# Altium project Platine_2_Intel_CPLD.PrjPcb
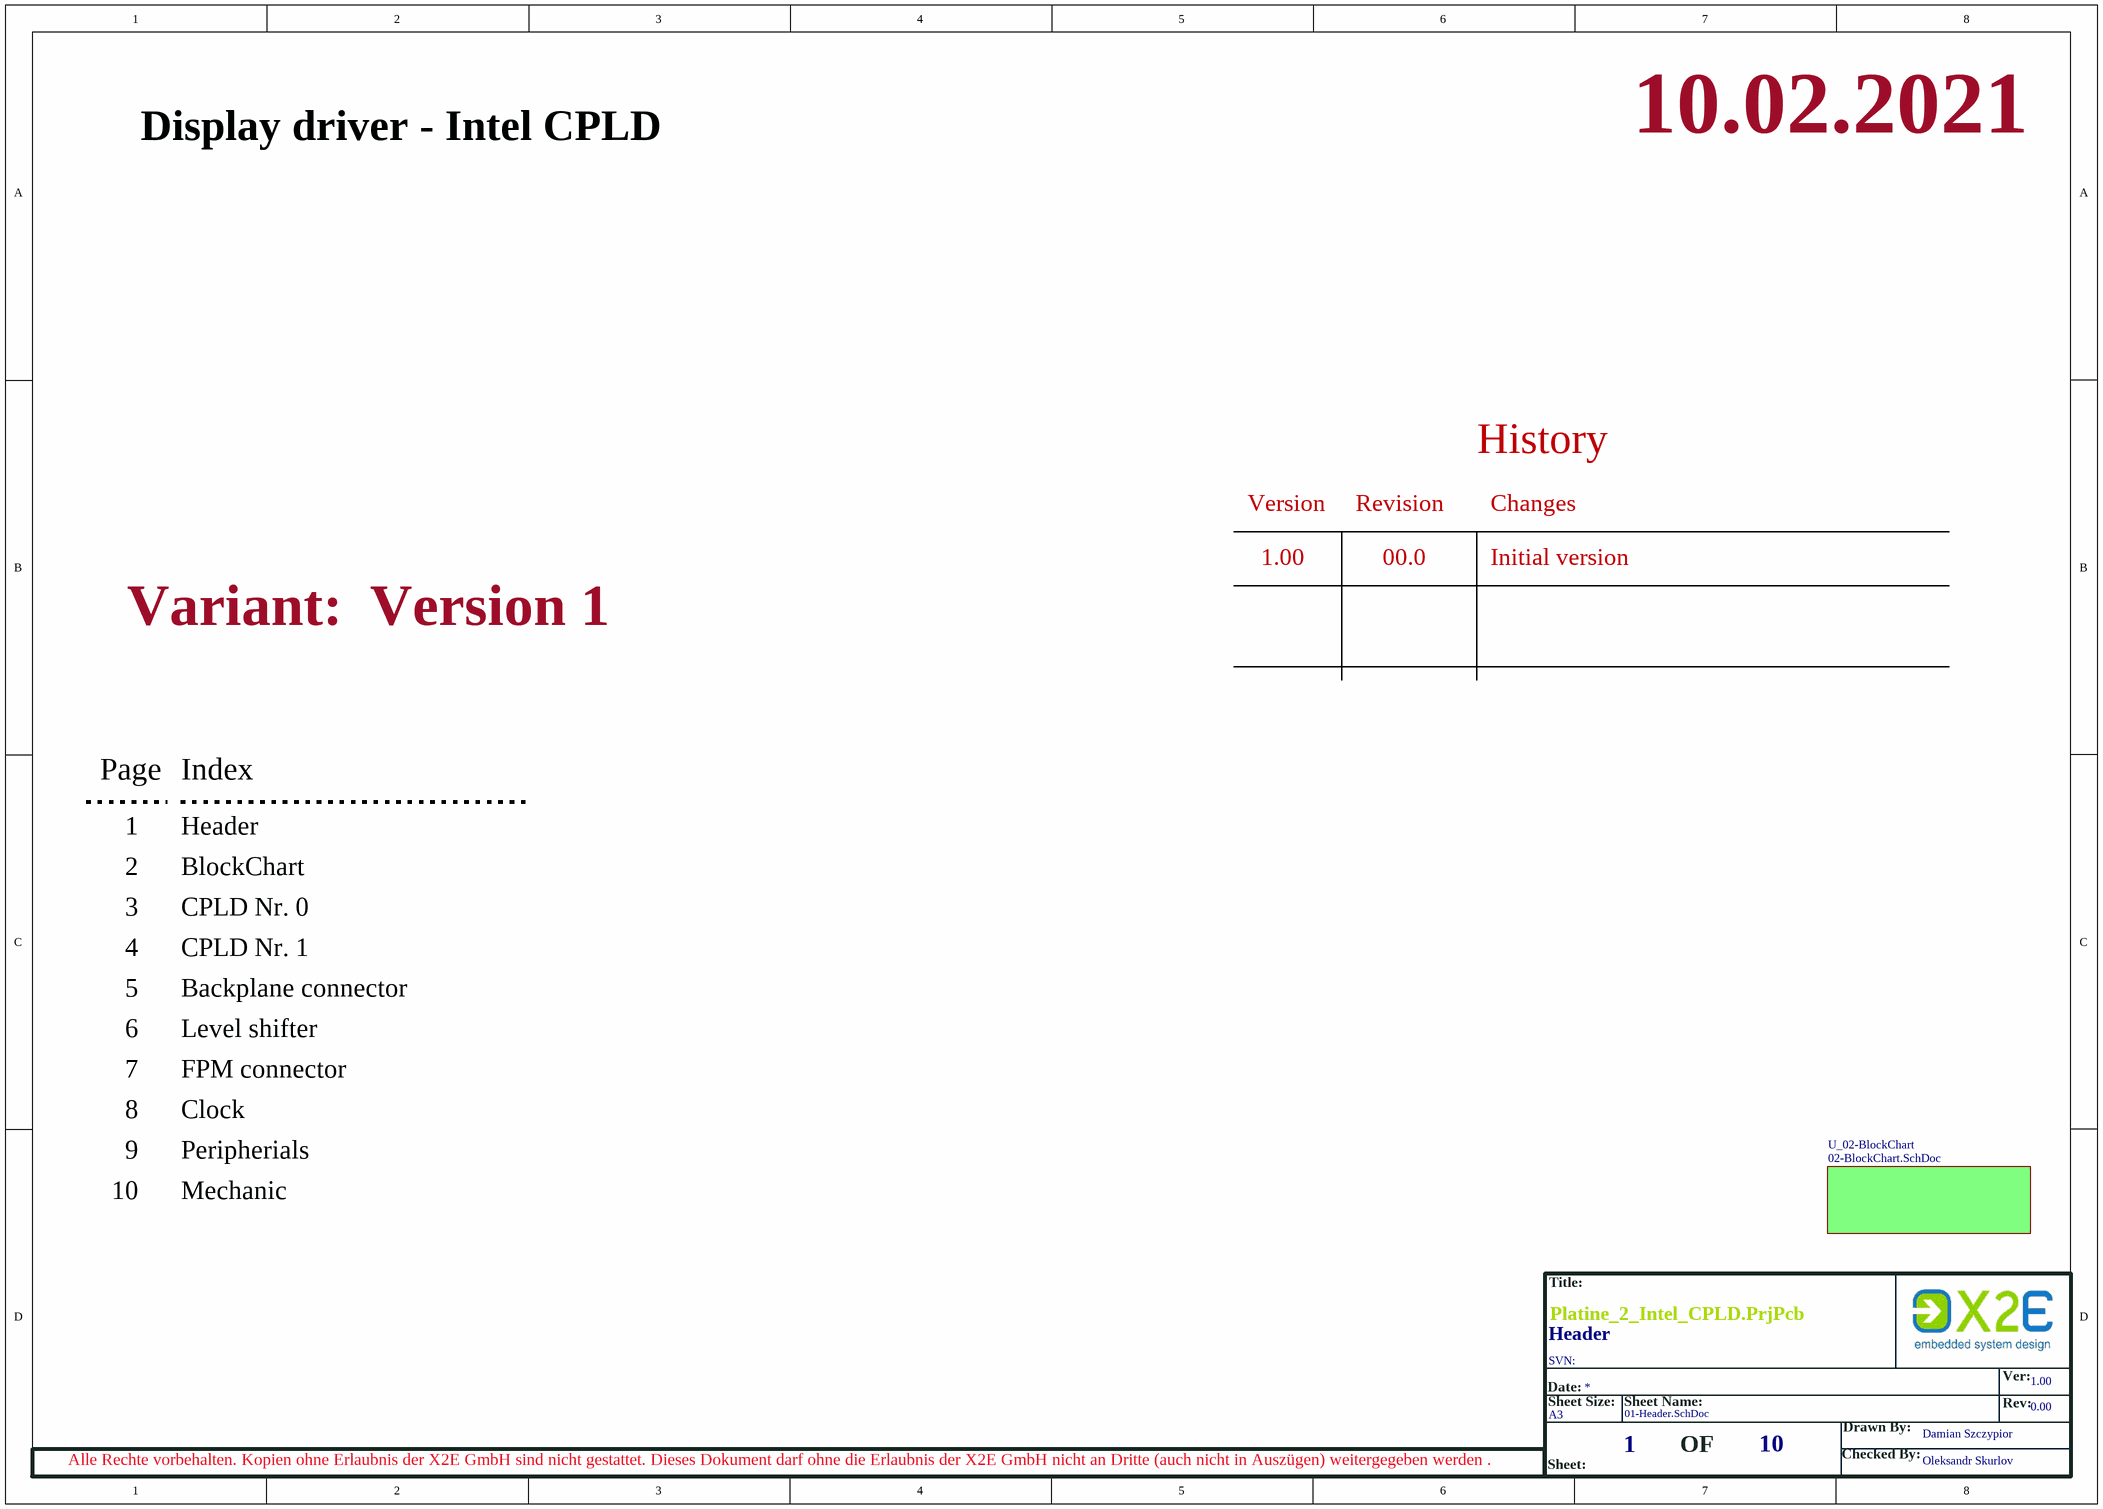
[diagram p0: 01-Header.SchDoc]
10 sheets, 93 parts. Net scope: hierarchical (ports join the sheet entries above them; power ports are global).
Board file: Platine_2_Intel_CPLD.PcbDoc
Sheets:
  01-Header.SchDoc
    U_02-BlockChart = 02-BlockChart.SchDoc
      U_09-Peripherials = 09-Peripherials.SchDoc
      U_03-Intel_CPLD_0 = 03-Intel_CPLD_0.SchDoc
      U_04-Intel_CPLD_1 = 04-Intel_CPLD_1.SchDoc
      U_05-Backplane_Connector = 05-Backplane_Connector.SchDoc
      U_06-LevelShifter = 06-LevelShifter.SchDoc
      U_08-Clock = 08-Clock.SchDoc
      U_07-FPM_Connector = 07-FPM_Connector.SchDoc
      U_10-Mechanic = 10-Mechanic.SchDoc

## Sheet 01-Header.SchDoc: Header
size A3; CheckedBy: Oleksandr Skurlov; CompanyName: X2E GmbH; Engineer: Nader Aribi; Revision: 0.00; SheetNumber: 1; SheetTotal: 10; Version: 1.00; Address: Jahnstr. 2b 76870 Kandel; PageSetup: Record=PageOptions|CenterHorizontal=True|CenterVertical=True|PrintScale=1.01|XCorrection=1.00|YCorrection=1.00|PrintKind=0|BorderSize=5000000|LeftOffset=0|BottomOffset=0|Orientation=2|PaperLength=1000|PaperWidth=1000|Scale=100|PaperSource=15|PrintQuality=600|MediaType=1|DitherType=10|PrintScaleMode=1|PaperKind=A3

### Sub-sheets
U_02-BlockChart = 02-BlockChart.SchDoc: no entries

### Notes on the sheet
- 10.02.2021
- Display driver - Intel CPLD
- Version
- Revision
- History
- Changes
- 1.00
- 00.0
- Initial version
- Variant:
- Version 1
- Page
- Index
- 1
- Header
- 2
- 3
- BlockChart
- CPLD Nr. 0
- 4
- CPLD Nr. 1
- 5
- 6
- Backplane connector
- Level shifter
- 7
- 8
- FPM connector
- Clock
- 9
- Peripherials
- 10
- Mechanic
- Title:
- Date:
- SVN:
- Ver:
- Sheet Size:
- A3
- Sheet Name:
- OF
- Checked By:
- Drawn By:
- Damian Szczypior
- Rev:
- Alle Rechte vorbehalten. Kopien ohne Erlaubnis der X2E GmbH sind nicht gestattet. Dieses Dokument darf ohne die Erlaubnis der X2E GmbH nicht an Dritte (auch nicht in Auszügen) weitergegeben werden .
- Sheet:

## Sheet 02-BlockChart.SchDoc
size A3; SheetNumber: 1; SheetTotal: 7
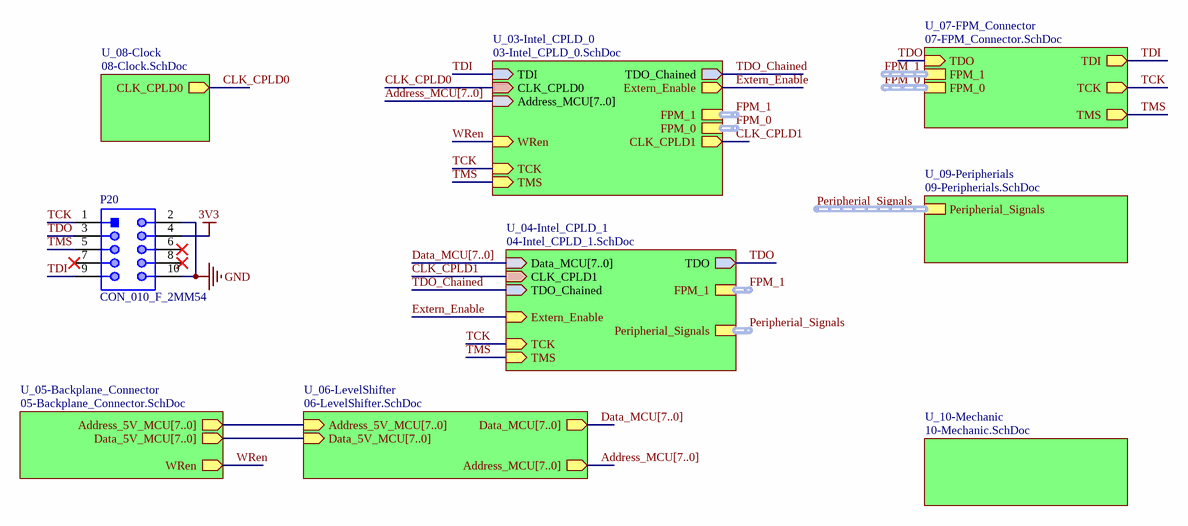
[diagram p1: 02-BlockChart.SchDoc]

### Parts
P20  CON_010_F_2MM54  [CON_010_F_2MM54_Intel_Altera]

### Sub-sheets
U_03-Intel_CPLD_0 = 03-Intel_CPLD_0.SchDoc: TDI (in), TDO_Chained (out), CLK_CPLD0 (in), Address_MCU[7..0] (in), Extern_Enable (out), FPM_1 (harness FPM_Signals_CPLD_1), FPM_0 (harness FPM_Signals_CPLD_0), WRen (in), CLK_CPLD1 (out), TCK (in), TMS (in)
U_04-Intel_CPLD_1 = 04-Intel_CPLD_1.SchDoc: Data_MCU[7..0] (in), CLK_CPLD1 (in), TDO_Chained (in), TDO (out), FPM_1 (harness FPM_Signals_CPLD_1), Extern_Enable (in), Peripherial_Signals (harness Peripherial_Signals), TCK (in), TMS (in)
U_05-Backplane_Connector = 05-Backplane_Connector.SchDoc: Address_5V_MCU[7..0] (out), Data_5V_MCU[7..0] (out), WRen (out)
U_06-LevelShifter = 06-LevelShifter.SchDoc: Address_5V_MCU[7..0] (in), Data_5V_MCU[7..0] (in), Data_MCU[7..0] (out), Address_MCU[7..0] (out)
U_07-FPM_Connector = 07-FPM_Connector.SchDoc: TDI (out), TDO (in), FPM_1 (harness FPM_Signals_CPLD_1), FPM_0 (harness FPM_Signals_CPLD_0), TCK (out), TMS (out)
U_08-Clock = 08-Clock.SchDoc: CLK_CPLD0 (out)
U_09-Peripherials = 09-Peripherials.SchDoc: Peripherial_Signals (harness Peripherial_Signals)
U_10-Mechanic = 10-Mechanic.SchDoc: no entries

### Nets
3V3: P20.4
GND: P20.2 P20.10
CLK_CPLD0: sheet U_03-Intel_CPLD_0/CLK_CPLD0, sheet U_08-Clock/CLK_CPLD0
CLK_CPLD1: sheet U_03-Intel_CPLD_0/CLK_CPLD1, sheet U_04-Intel_CPLD_1/CLK_CPLD1
Extern_Enable: sheet U_03-Intel_CPLD_0/Extern_Enable, sheet U_04-Intel_CPLD_1/Extern_Enable
TCK: P20.1 ; sheet U_03-Intel_CPLD_0/TCK, sheet U_04-Intel_CPLD_1/TCK, sheet U_07-FPM_Connector/TCK
TDI: P20.9 ; sheet U_03-Intel_CPLD_0/TDI, sheet U_07-FPM_Connector/TDI
TDO: P20.3 ; sheet U_04-Intel_CPLD_1/TDO, sheet U_07-FPM_Connector/TDO
TDO_Chained: sheet U_03-Intel_CPLD_0/TDO_Chained, sheet U_04-Intel_CPLD_1/TDO_Chained
TMS: P20.5 ; sheet U_03-Intel_CPLD_0/TMS, sheet U_04-Intel_CPLD_1/TMS, sheet U_07-FPM_Connector/TMS
WRen: sheet U_03-Intel_CPLD_0/WRen, sheet U_05-Backplane_Connector/WRen

Not connected (* = marked no-connect by the designer): P20 6* 7* 8*

### Buses and harness runs
bus Address_MCU[7..0] = sheet U_03-Intel_CPLD_0/Address_MCU[7..0]
bus Address_MCU[7..0] = sheet U_06-LevelShifter/Address_MCU[7..0]
bus Data_MCU[7..0] = sheet U_04-Intel_CPLD_1/Data_MCU[7..0]
bus Data_MCU[7..0] = sheet U_06-LevelShifter/Data_MCU[7..0]
bus sheet U_05-Backplane_Connector/Address_5V_MCU[7..0] = sheet U_06-LevelShifter/Address_5V_MCU[7..0]
bus sheet U_05-Backplane_Connector/Data_5V_MCU[7..0] = sheet U_06-LevelShifter/Data_5V_MCU[7..0]
harness FPM_0 = sheet U_03-Intel_CPLD_0/FPM_0
harness FPM_0 = sheet U_07-FPM_Connector/FPM_0
harness FPM_1 = sheet U_03-Intel_CPLD_0/FPM_1
harness FPM_1 = sheet U_04-Intel_CPLD_1/FPM_1
harness FPM_1 = sheet U_07-FPM_Connector/FPM_1
harness Peripherial_Signals = sheet U_04-Intel_CPLD_1/Peripherial_Signals
harness Peripherial_Signals = sheet U_09-Peripherials/Peripherial_Signals

### Notes on the sheet
- Title:
- Date:
- SVN:
- Ver:
- Sheet Size:
- A3
- Sheet Name:
- OF
- Checked By:
- Drawn By:
- Damian Szczypior
- Rev:
- Alle Rechte vorbehalten. Kopien ohne Erlaubnis der X2E GmbH sind nicht gestattet. Dieses Dokument darf ohne die Erlaubnis der X2E GmbH nicht an Dritte (auch nicht in Auszügen) weitergegeben werden .
- Sheet:

### Library data of the parts
P20 = CON_010_F_2MM54: Male Box Header WR-BHD, THT, Vertical, pitch 2.54 mm, 10 pins

## Sheet 09-Peripherials.SchDoc
size A3; SheetNumber: 2; SheetTotal: 7
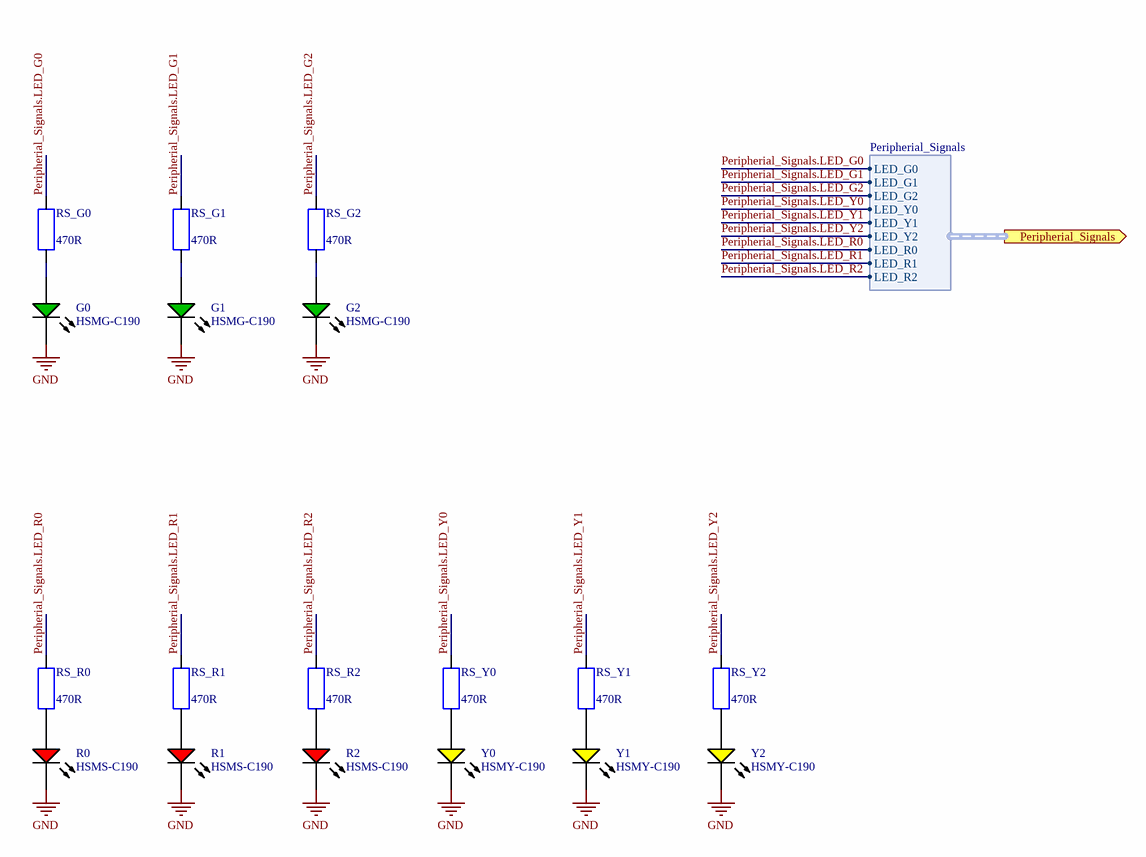
[diagram p2: 09-Peripherials.SchDoc]

### Parts
G0  HSMG-C190  [AVAG-HSMX-C190_V]
G1  HSMG-C190  [AVAG-HSMX-C190_V]
G2  HSMG-C190  [AVAG-HSMX-C190_V]
R0  HSMS-C190  [AVAG-HSMX-C190_V]
R1  HSMS-C190  [AVAG-HSMX-C190_V]
R2  HSMS-C190  [AVAG-HSMX-C190_V]
RS_G0  resistance: 470R  [0603_A]  (hidden comment: RS)
RS_G1  resistance: 470R  [0603_A]  (hidden comment: RS)
RS_G2  resistance: 470R  [0603_A]  (hidden comment: RS)
RS_R0  resistance: 470R  [0603_A]  (hidden comment: RS)
RS_R1  resistance: 470R  [0603_A]  (hidden comment: RS)
RS_R2  resistance: 470R  [0603_A]  (hidden comment: RS)
RS_Y0  resistance: 470R  [0603_A]  (hidden comment: RS)
RS_Y1  resistance: 470R  [0603_A]  (hidden comment: RS)
RS_Y2  resistance: 470R  [0603_A]  (hidden comment: RS)
Y0  HSMY-C190  [AVAG-HSMX-C190_V]
Y1  HSMY-C190  [AVAG-HSMX-C190_V]
Y2  HSMY-C190  [AVAG-HSMX-C190_V]

### Ports
Peripherial_Signals (out, harness Peripherial_Signals)

### Harnesses
Peripherial_Signals: LED_G0, LED_G1, LED_G2, LED_Y0, LED_Y1, LED_Y2, LED_R0, LED_R1, LED_R2

### Nets
GND: G0.2(K) G1.2(K) G2.2(K) R0.2(K) R1.2(K) R2.2(K) Y0.2(K) Y1.2(K) Y2.2(K)
Peripherial_Signals.LED_G0: RS_G0.2 ; port Peripherial_Signals.LED_G0
Peripherial_Signals.LED_G1: RS_G1.2 ; port Peripherial_Signals.LED_G1
Peripherial_Signals.LED_G2: RS_G2.2 ; port Peripherial_Signals.LED_G2
Peripherial_Signals.LED_R0: RS_R0.2 ; port Peripherial_Signals.LED_R0
Peripherial_Signals.LED_R1: RS_R1.2 ; port Peripherial_Signals.LED_R1
Peripherial_Signals.LED_R2: RS_R2.2 ; port Peripherial_Signals.LED_R2
Peripherial_Signals.LED_Y0: RS_Y0.2 ; port Peripherial_Signals.LED_Y0
Peripherial_Signals.LED_Y1: RS_Y1.2 ; port Peripherial_Signals.LED_Y1
Peripherial_Signals.LED_Y2: RS_Y2.2 ; port Peripherial_Signals.LED_Y2
NetG0_1: G0.1(A) RS_G0.1
NetG1_1: G1.1(A) RS_G1.1
NetG2_1: G2.1(A) RS_G2.1
NetR0_1: R0.1(A) RS_R0.1
NetR1_1: R1.1(A) RS_R1.1
NetR2_1: R2.1(A) RS_R2.1
NetRS_Y0_1: RS_Y0.1 Y0.1(A)
NetRS_Y1_1: RS_Y1.1 Y1.1(A)
NetRS_Y2_1: RS_Y2.1 Y2.1(A)

### Notes on the sheet
- Title:
- Date:
- SVN:
- Ver:
- Sheet Size:
- A3
- Sheet Name:
- OF
- Checked By:
- Drawn By:
- Damian Szczypior
- Rev:
- Alle Rechte vorbehalten. Kopien ohne Erlaubnis der X2E GmbH sind nicht gestattet. Dieses Dokument darf ohne die Erlaubnis der X2E GmbH nicht an Dritte (auch nicht in Auszügen) weitergegeben werden .
- Sheet:

### Library data of the parts
G0-G2 = CMP-1744-00002-1: Chip LED, Green, 2.2 V, -40 to 85 degC, 2-Pin SMD, RoHS, Tape and Reel; Frequency: 400 KHz; Max Supply Voltage: 5.5 V; Access Time: 3500 ns; Clock Frequency: 100 KHz; Case\Package: SOIC; Density: 32 kb; Nominal Supply Current: 2 mA; Interface: Serial; Min Supply Voltage: 1.7 V; Packaging: Tape and Reel; PackageReference: HSMX-C190; ComponentLink2URL: http://docs.avagotech.com/docs/AV02-0551EN; RoHSCompliant: true; Pins: 8; REACH SVHC: No SVHC; Max Operating Temperature: 85 degC; Width: 4 mm; Radiation Hardening: No; Package Quantity: 3000; ComponentLink3Description: Package Specification; ComponentLink1Description: Manufacturer URL; Min Operating Temperature: -40 degC; PackageDescription: 2-Pin Surface Mount Device, Body 1.6 x 0.8 mm, Height 0.9 mm; Max Clock Frequency: 100 KHz; Height: 1.5 mm; ComponentLink1URL: http://www.avagotech.com/; DatasheetVersion: Mar-12; ComponentLink2Description: Datasheet; Mount: Surface Mount; Length: 5 mm; ComponentLink3URL: http://www.fairchildsemi.com/dwg/MA/MA03D.pdf
R0-R2 = CMP-2000-06427-1: LED Uni-Color Red, 52 mW, 20 mA, -40 to 85 degC, 2-Pin SMD, RoHS, Tape and Reel; Manufacturer: Avago; Reverse Voltage: 5V; Viewing Angle: 170deg; High Brightness: No; Lens Type: ColorlessDiffused; DELETED: Compliant; Product Height (mm): 0.8mm; Dominant Wave Length: 626nm; Number of  Elements: 1; Chip Material: GaP; Lum Intensity: 10mcd; Product Length (mm): 1.6mm; Forward Voltage: 2.6V; Power Dissipation: 52W; Shape Type: Rectangular; Forward Current: 25mA; Peak Wavelength: 630nm; Test Current (It): 20mA; Main Category: ChipLED; Lens Dimensions: 1x0.8x0.5mm; Pin Count: 2; Package Reference: HSMX-C190; Mounting Technology: SurfaceMount; Mounting: SurfaceMount; Datasheet URL: http://docs.avagotech.com/docs/AV02-0551EN; Package Type: ChipLed; Operating Temperature Classification: Industrial; Datasheet Version: 03/2012; Operating Temp Range: -40Cto85C; Emitting Color: Red; Rad Hardened: No; Manufacturer URL: http://www.avagotech.com/; Luminous Intensity: 10mcd; Package Description: 2-Pin Surface Mount Device, Body 1.6 x 0.8 mm, Height 0.9 mm; Type: Uni-Color; Packaging: TapeandReel; Product Depth (mm): 0.8mm
RS_G0-RS_G2 RS_R0-RS_R2 RS_Y0-RS_Y2 = X_00000061: manufacturer: Yageo; entity_name: RS_0603_470R_W100_1P00_100PPM; entity_type_name: resistor_standard; power: W100; temp_coefficient: 100PPM; tolerance: 1P00; release: blocked; max_operating_temp: 125C; min_operating_temp: -55C; ordering_information_btm: 311-470HRDKR-ND; used_in_bom: 1; production_status: Aktiv; x2e_number: X_00000061; series: RC0603; height: mm450; width: mm800; length: 1mm60; package: 0603
Y0-Y2 = CMP-1744-00003-1: LED Uni-Color Yellow, 65 mW, 20 mA, -40 to 85 degC, 2-Pin SMD, RoHS, Tape and Reel; Tolerance: 1%; Voltage Rating: 50 V; Power Rating: 100 mW; Case\Package: 0603; Resistance: 390 Ohm; Min Operating Temperature: -55 degC; Length: 1.6 mm; ComponentLink3Description: Package Specification; Mount: Surface Mount; PackageReference: HSMX-C190; ComponentLink2Description: Datasheet; DatasheetVersion: Mar-12; Case Code (Metric): 1608; Pins: 2; Package Quantity: 5000; ComponentLink2URL: http://docs.avagotech.com/docs/AV02-0551EN; ComponentLink1Description: Manufacturer URL; RoHSCompliant: true; Packaging: Tape and Reel; PackageDescription: 2-Pin Surface Mount Device, Body 1.6 x 0.8 mm, Height 0.9 mm; REACH SVHC: No SVHC; ComponentLink3URL: http://www.fairchildsemi.com/dwg/MA/MA03D.pdf; Voltage Rating (DC): 50 V; Width: 0.8 mm; ComponentLink1URL: http://www.avagotech.com/; Max Operating Temperature: 155 degC; Case Code (Imperial): 0603; Height: 0.45 mm

## Sheet 03-Intel_CPLD_0.SchDoc
size A3; SheetNumber: 5; SheetTotal: 7
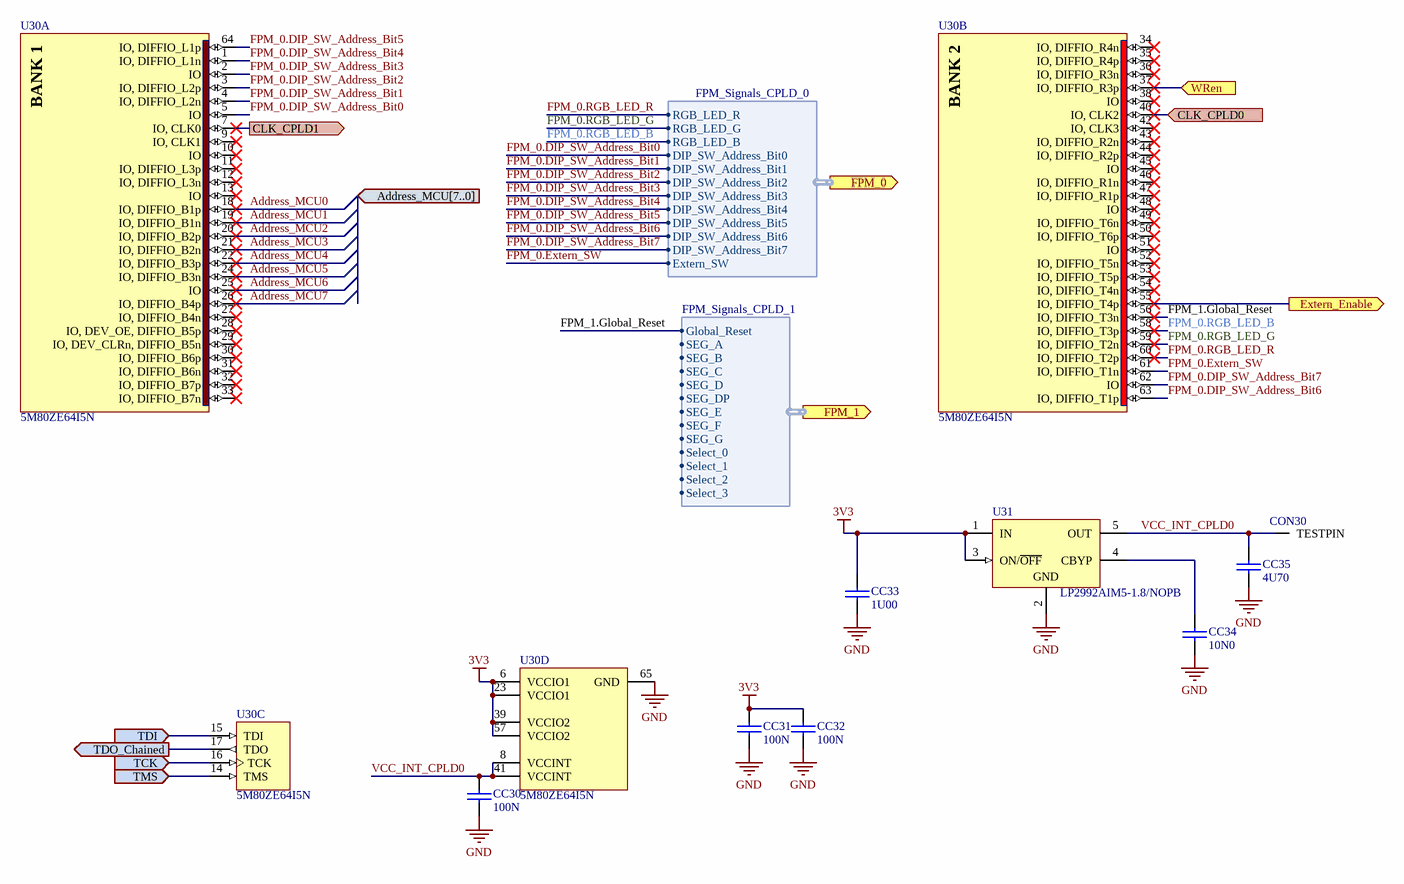
[diagram p3: 03-Intel_CPLD_0.SchDoc]

### Parts
CC30  capacitance: 100N  [0603_C]  (hidden comment: CC)
CC31  capacitance: 100N  [0603_C]  (hidden comment: CC)
CC32  capacitance: 100N  [0603_C]  (hidden comment: CC)
CC33  capacitance: 1U00  [0603_C]  (hidden comment: CC)
CC34  capacitance: 10N0  [0603_C]  (hidden comment: CC)
CC35  capacitance: 4U70  [0603_C]  (hidden comment: CC)
CON30  CON_001_M_MM000_S_X_MILL-MAX_TP  [CON_001_THT_MM000_S_D]  (value not drawn)
U30  5M80ZE64I5N  [EQFP64_A-120_D2-45_M]  (parts A,B,C,D of 4)
U31  LP2992AIM5-1.8/NOPB  [MF05A_N]

### Ports
Address_MCU[7..0] (in), CLK_CPLD0 (in), CLK_CPLD1 (out), Extern_Enable (out), FPM_0 (out, harness FPM_Signals_CPLD_0), FPM_1 (out, harness FPM_Signals_CPLD_1), TCK (in), TDI (in), TDO_Chained (out), TMS (in), WRen (in)

### Harnesses
FPM_Signals_CPLD_0: RGB_LED_R, RGB_LED_G, RGB_LED_B, DIP_SW_Address_Bit0, DIP_SW_Address_Bit1, DIP_SW_Address_Bit2, DIP_SW_Address_Bit3, DIP_SW_Address_Bit4, DIP_SW_Address_Bit5, DIP_SW_Address_Bit6, DIP_SW_Address_Bit7, Extern_SW
FPM_Signals_CPLD_1: Global_Reset, SEG_A, SEG_B, SEG_C, SEG_D, SEG_DP, SEG_E, SEG_F, SEG_G, Select_0, Select_1, Select_2, Select_3

### Nets
3V3: CC31.2 CC32.2 CC33.2 U30.6(VCCIO1) U30.23(VCCIO1) U30.39(VCCIO2) U30.57(VCCIO2) U31.1(IN) U31.3(ON/~{OFF})
GND: CC30.1 CC31.1 CC32.1 CC33.1 CC34.1 CC35.1 U30.65(GND) U31.2(GND)
Address_MCU0: U30.18(IO,_DIFFIO_B1p)
Address_MCU1: U30.19(IO,_DIFFIO_B1n)
Address_MCU2: U30.20(IO,_DIFFIO_B2p)
Address_MCU3: U30.21(IO,_DIFFIO_B2n)
Address_MCU4: U30.22(IO,_DIFFIO_B3p)
Address_MCU5: U30.24(IO,_DIFFIO_B3n)
Address_MCU6: U30.25(IO)
Address_MCU7: U30.26(IO,_DIFFIO_B4p)
CLK_CPLD0: U30.40(IO,_CLK2) ; port CLK_CPLD0
CLK_CPLD1: U30.7(IO,_CLK0) ; port CLK_CPLD1
Extern_Enable: U30.55(IO,_DIFFIO_T4p) ; port Extern_Enable
FPM_0.DIP_SW_Address_Bit0: U30.5(IO) ; port FPM_0.DIP_SW_Address_Bit0
FPM_0.DIP_SW_Address_Bit1: U30.4(IO,_DIFFIO_L2n) ; port FPM_0.DIP_SW_Address_Bit1
FPM_0.DIP_SW_Address_Bit2: U30.3(IO,_DIFFIO_L2p) ; port FPM_0.DIP_SW_Address_Bit2
FPM_0.DIP_SW_Address_Bit3: U30.2(IO) ; port FPM_0.DIP_SW_Address_Bit3
FPM_0.DIP_SW_Address_Bit4: U30.1(IO,_DIFFIO_L1n) ; port FPM_0.DIP_SW_Address_Bit4
FPM_0.DIP_SW_Address_Bit5: U30.64(IO,_DIFFIO_L1p) ; port FPM_0.DIP_SW_Address_Bit5
FPM_0.DIP_SW_Address_Bit6: U30.63(IO,_DIFFIO_T1p) ; port FPM_0.DIP_SW_Address_Bit6
FPM_0.DIP_SW_Address_Bit7: U30.62(IO) ; port FPM_0.DIP_SW_Address_Bit7
FPM_0.Extern_SW: U30.61(IO,_DIFFIO_T1n) ; port FPM_0.Extern_SW
FPM_0.RGB_LED_B: U30.58(IO,_DIFFIO_T3p) ; port FPM_0.RGB_LED_B
FPM_0.RGB_LED_G: U30.59(IO,_DIFFIO_T2n) ; port FPM_0.RGB_LED_G
FPM_0.RGB_LED_R: U30.60(IO,_DIFFIO_T2p) ; port FPM_0.RGB_LED_R
FPM_1.Global_Reset: U30.56(IO,_DIFFIO_T3n) ; port FPM_1.Global_Reset
TCK: U30.16(TCK) ; port TCK
TDI: U30.15(TDI) ; port TDI
TDO_Chained: U30.17(TDO) ; port TDO_Chained
TMS: U30.14(TMS) ; port TMS
VCC_INT_CPLD0: CC30.2 CC35.2 CON30.1(TESTPIN) U30.8(VCCINT) U30.41(VCCINT) U31.5(OUT)
WRen: U30.37(IO,_DIFFIO_R3p) ; port WRen
NetCC34_2: CC34.2 U31.4(CBYP)

Not connected (* = marked no-connect by the designer): U30 9(IO,_CLK1)* 10(IO)* 11(IO,_DIFFIO_L3p)* 12(IO,_DIFFIO_L3n)* 13(IO)* 27(IO,_DIFFIO_B4n)* 28(IO,_DEV_OE,_DIFFIO_B5p)* 29(IO,_DEV_CLRn,_DIFFIO_B5n)* 30(IO,_DIFFIO_B6p)* 31(IO,_DIFFIO_B6n)* 32(IO,_DIFFIO_B7p)* 33(IO,_DIFFIO_B7n)* 34(IO,_DIFFIO_R4n)* 35(IO,_DIFFIO_R4p)* 36(IO,_DIFFIO_R3n)* 38(IO)* 42(IO,_CLK3)* 43(IO,_DIFFIO_R2n)* 44(IO,_DIFFIO_R2p)* 45(IO)* 46(IO,_DIFFIO_R1n)* 47(IO,_DIFFIO_R1p)* 48(IO)* 49(IO,_DIFFIO_T6n)* 50(IO,_DIFFIO_T6p)* 51(IO)* 52(IO,_DIFFIO_T5n)* 53(IO,_DIFFIO_T5p)* 54(IO,_DIFFIO_T4n)*

### Notes on the sheet
- Title:
- Date:
- SVN:
- Ver:
- Sheet Size:
- A3
- Sheet Name:
- OF
- Checked By:
- Drawn By:
- Damian Szczypior
- Rev:
- Alle Rechte vorbehalten. Kopien ohne Erlaubnis der X2E GmbH sind nicht gestattet. Dieses Dokument darf ohne die Erlaubnis der X2E GmbH nicht an Dritte (auch nicht in Auszügen) weitergegeben werden .
- Sheet:
- (in symbol CMP-0217-00123-1, part A) BANK 1
- (in symbol CMP-0217-00123-1, part B) BANK 2

### Library data of the parts
CC30-CC32 = X_00000681: manufacturer: Yageo; entity_name: CC_0603_100N_50V0_10P0_X7R; entity_type_name: capacitor_ceramic; temp_coefficient: X7R; release: blocked; max_operating_temp: 125C; min_operating_temp: -55C; tolerance: 10P0; voltage_rated: 50V0; ordering_information_btm: 311-1344-6-ND; used_in_bom: 1; production_status: Aktiv; x2e_number: X_00000681; height: mm900; width: mm800; length: 1mm60; package: 0603; series: none
CC33 = X_00001611: manufacturer: Taiyo Yuden; entity_name: CC_0603_1U00_50V0_10P0_X7R; entity_type_name: capacitor_ceramic; temp_coefficient: X7R; release: blocked; max_operating_temp: 125C; min_operating_temp: -55C; tolerance: 10P0; voltage_rated: 50V0; ordering_information_btm: 587-3247-6-ND; used_in_bom: 1; production_status: Aktiv; x2e_number: X_00001611; height: mm800; width: mm800; length: 1mm60; package: 0603; series: M
CC34 = X_00000431: manufacturer: Kemet; entity_name: CC_0603_10N0_50V0_10P0_X7R; entity_type_name: capacitor_ceramic; temp_coefficient: X7R; release: blocked; max_operating_temp: 125C; min_operating_temp: -55C; tolerance: 10P0; voltage_rated: 50V0; ordering_information_btm: 399-1091-6-ND; used_in_bom: 1; production_status: Aktiv; x2e_number: X_00000431; height: mm800; width: mm800; length: 1mm60; package: 0603; series: none
CC35 = X_00002029: manufacturer: Samsung; entity_name: CC_0603_4U70_6V30_10P0_X7R; entity_type_name: capacitor_ceramic; temp_coefficient: X7R; release: blocked; max_operating_temp: 125C; min_operating_temp: -55C; tolerance: 10P0; voltage_rated: 6V30; ordering_information_btm: 1276-2087-6-ND; used_in_bom: 1; production_status: Aktiv; x2e_number: X_00002029; height: mm800; width: mm800; length: 1mm60; package: 0603; series: CL
CON30 = X_00001838: MILL-MAX_TP; ordering_information: digikey, ED90581-ND; entity_type_name: connector; release: blocked; max_operating_temp: 0C; grid: MM000; pin_count_type: X; mounting_type: S; gender: M; number_of_electronic_pins: 001; ordering_information_btm: ED90581-ND; used_in_bom: 1; production_status: Aktiv; editor_date: boos, 06.02.2014; x2e_number: X_00001838; entity_name: CON_001_M_MM000_S_X_MILL-MAX_TP; height: 5mm56; width: 3mm18; length: 3mm18; min_operating_temp: 0C; manufacturer: MILL-MAX; package: THT; shell_material: Tin; series: 2501
U30 = CMP-0217-00123-1: MAX V 1.8V CPLD, 54 IOs, 80 Logic Elements, 64-Pin EQFP, Industrial Temperature, Speed Grade 5, Pb-Free; ComponentLink2URL: http://www.altera.com/literature/hb/max-v/max5_handbook.pdf; ComponentLink4Description: Package Specification; ComponentLink1URL: http://www.altera.com/; ComponentLink1Description: Manufacturer URL; ComponentLink2Description: Datasheet; DatasheetVersion: ver1.2, May-2011; ComponentLink3URL: http://www.altera.com/literature/lit-dp.jsp?category=MAX%205&showspreadsheet=y; ComponentLink4URL: http://www.altera.com/devicepackaging/04R00384-01.pdf; Code_JEDEC: MS-026-ABD-HD; PackageVersion: ver1.0, Jul-2011; PackageDescription: 64-Pin Plastic Enhanced Quad Flat (EQFP) - Wire Bond - A:1.20 - D2:4.5; ComponentLink3Description: MAX V Device Pin-Out files; PackageReference: EQFP64_A-120_D2-45
U31 = CMP-0062-02117-2: Micropower 250 mA Low-Noise Ultra Low-Dropout Regulator, 5-pin SOT-23, Pb-Free; Manufacturer: National Semiconductor; PowerWise: N; PackageTopMarking: LFCA*XTT; CompType: LDO IC; ComponentLink1URL: http://www.national.com/ds/LP/LP2992.pdf; PinCount: 5; PackageReference: MF05A; PackageVersion: revD, Aug-2008; ComponentLink3URL: http://www.national.com/packaging/folders/mf05a.html; DatasheetVersion: May-2005; ComponentLink2URL: http://www.national.com/pf/LP/LP2992.html; RevisionNote: Component URLs added; ComponentLink2Description: LP2992 Web Page; ComponentLink1Description: LP2992 Datasheet; RoHS: Y; PackageDescription: Molded SOT-23, .115 x .063 x .040 in Body, 5 Lead, .0375 in Pitch; ComponentLink3Description: MF05A Package Page

## Sheet 04-Intel_CPLD_1.SchDoc
size A3; SheetNumber: 6; SheetTotal: 7
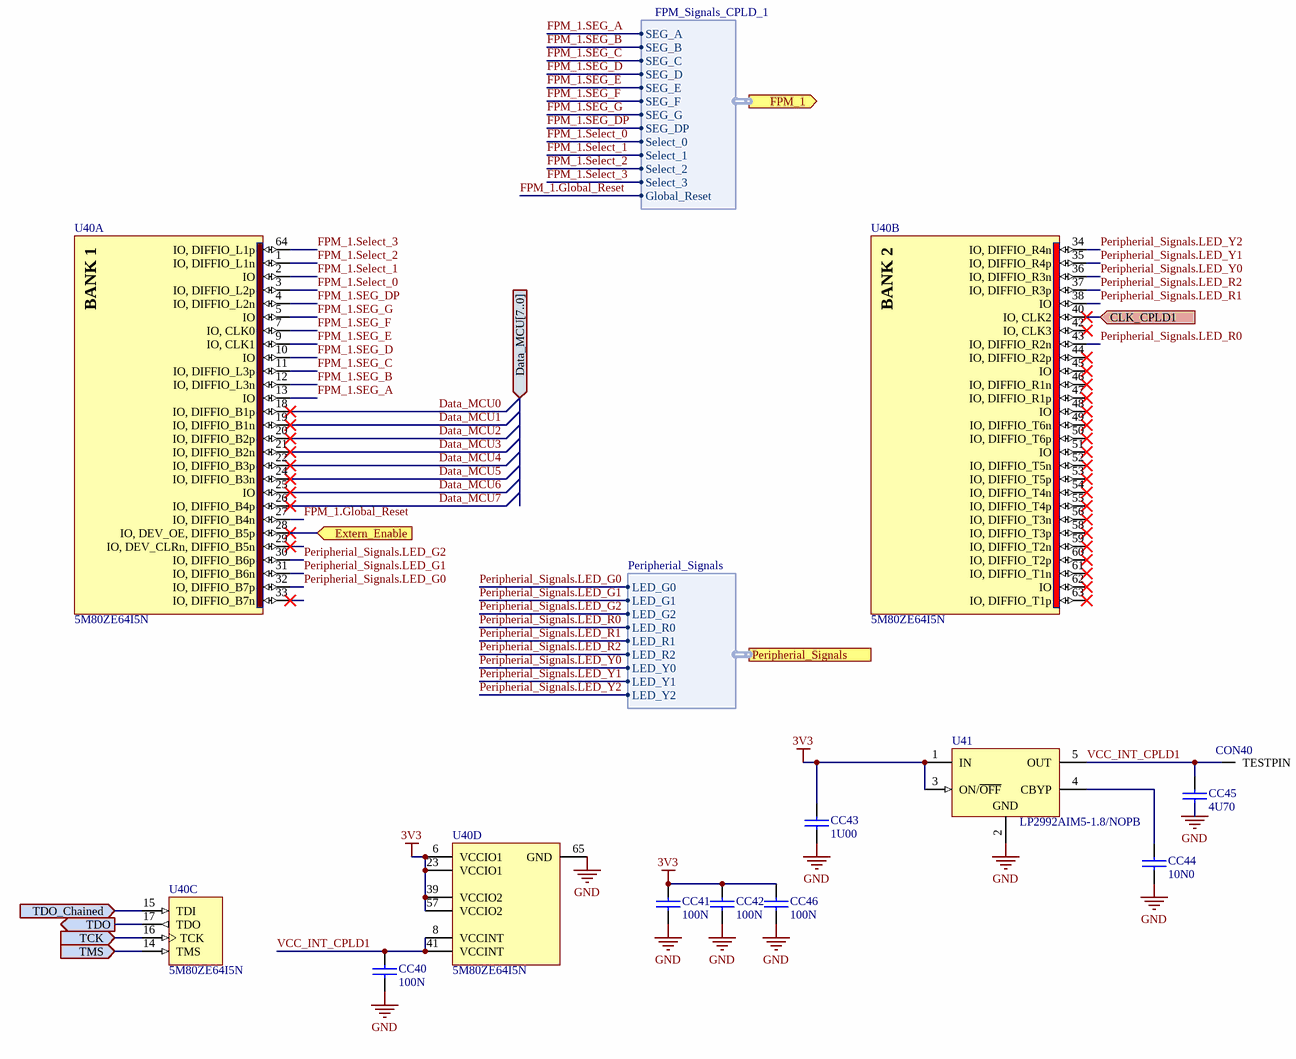
[diagram p4: 04-Intel_CPLD_1.SchDoc]

### Parts
CC40  capacitance: 100N  [0603_C]  (hidden comment: CC)
CC41  capacitance: 100N  [0603_C]  (hidden comment: CC)
CC42  capacitance: 100N  [0603_C]  (hidden comment: CC)
CC43  capacitance: 1U00  [0603_C]  (hidden comment: CC)
CC44  capacitance: 10N0  [0603_C]  (hidden comment: CC)
CC45  capacitance: 4U70  [0603_C]  (hidden comment: CC)
CC46  capacitance: 100N  [0603_C]  (hidden comment: CC)
CON40  CON_001_M_MM000_S_X_MILL-MAX_TP  [CON_001_THT_MM000_S_D]  (value not drawn)
U40  5M80ZE64I5N  [EQFP64_A-120_D2-45_M]  (parts A,B,C,D of 4)
U41  LP2992AIM5-1.8/NOPB  [MF05A_N]

### Ports
CLK_CPLD1 (in), Data_MCU[7..0] (in), Extern_Enable (in), FPM_1 (out, harness FPM_Signals_CPLD_1), Peripherial_Signals (harness Peripherial_Signals), TCK (in), TDO (out), TDO_Chained (in), TMS (in)

### Harnesses
FPM_Signals_CPLD_1: SEG_A, SEG_B, SEG_C, SEG_D, SEG_E, SEG_F, SEG_G, SEG_DP, Select_0, Select_1, Select_2, Select_3, Global_Reset
Peripherial_Signals: LED_G0, LED_G1, LED_G2, LED_R0, LED_R1, LED_R2, LED_Y0, LED_Y1, LED_Y2

### Nets
3V3: CC41.2 CC42.2 CC43.2 CC46.2 U40.6(VCCIO1) U40.23(VCCIO1) U40.39(VCCIO2) U40.57(VCCIO2) U41.1(IN) U41.3(ON/~{OFF})
GND: CC40.1 CC41.1 CC42.1 CC43.1 CC44.1 CC45.1 CC46.1 U40.65(GND) U41.2(GND)
CLK_CPLD1: U40.40(IO,_CLK2) ; port CLK_CPLD1
Data_MCU0: U40.18(IO,_DIFFIO_B1p)
Data_MCU1: U40.19(IO,_DIFFIO_B1n)
Data_MCU2: U40.20(IO,_DIFFIO_B2p)
Data_MCU3: U40.21(IO,_DIFFIO_B2n)
Data_MCU4: U40.22(IO,_DIFFIO_B3p)
Data_MCU5: U40.24(IO,_DIFFIO_B3n)
Data_MCU6: U40.25(IO)
Data_MCU7: U40.26(IO,_DIFFIO_B4p)
Extern_Enable: U40.28(IO,_DEV_OE,_DIFFIO_B5p) ; port Extern_Enable
FPM_1.Global_Reset: U40.27(IO,_DIFFIO_B4n) ; port FPM_1.Global_Reset
FPM_1.SEG_A: U40.13(IO) ; port FPM_1.SEG_A
FPM_1.SEG_B: U40.12(IO,_DIFFIO_L3n) ; port FPM_1.SEG_B
FPM_1.SEG_C: U40.11(IO,_DIFFIO_L3p) ; port FPM_1.SEG_C
FPM_1.SEG_D: U40.10(IO) ; port FPM_1.SEG_D
FPM_1.SEG_DP: U40.4(IO,_DIFFIO_L2n) ; port FPM_1.SEG_DP
FPM_1.SEG_E: U40.9(IO,_CLK1) ; port FPM_1.SEG_E
FPM_1.SEG_F: U40.7(IO,_CLK0) ; port FPM_1.SEG_F
FPM_1.SEG_G: U40.5(IO) ; port FPM_1.SEG_G
FPM_1.Select_0: U40.3(IO,_DIFFIO_L2p) ; port FPM_1.Select_0
FPM_1.Select_1: U40.2(IO) ; port FPM_1.Select_1
FPM_1.Select_2: U40.1(IO,_DIFFIO_L1n) ; port FPM_1.Select_2
FPM_1.Select_3: U40.64(IO,_DIFFIO_L1p) ; port FPM_1.Select_3
Peripherial_Signals.LED_G0: U40.32(IO,_DIFFIO_B7p) ; port Peripherial_Signals.LED_G0
Peripherial_Signals.LED_G1: U40.31(IO,_DIFFIO_B6n) ; port Peripherial_Signals.LED_G1
Peripherial_Signals.LED_G2: U40.30(IO,_DIFFIO_B6p) ; port Peripherial_Signals.LED_G2
Peripherial_Signals.LED_R0: U40.43(IO,_DIFFIO_R2n) ; port Peripherial_Signals.LED_R0
Peripherial_Signals.LED_R1: U40.38(IO) ; port Peripherial_Signals.LED_R1
Peripherial_Signals.LED_R2: U40.37(IO,_DIFFIO_R3p) ; port Peripherial_Signals.LED_R2
Peripherial_Signals.LED_Y0: U40.36(IO,_DIFFIO_R3n) ; port Peripherial_Signals.LED_Y0
Peripherial_Signals.LED_Y1: U40.35(IO,_DIFFIO_R4p) ; port Peripherial_Signals.LED_Y1
Peripherial_Signals.LED_Y2: U40.34(IO,_DIFFIO_R4n) ; port Peripherial_Signals.LED_Y2
TCK: U40.16(TCK) ; port TCK
TDO: U40.17(TDO) ; port TDO
TDO_Chained: U40.15(TDI) ; port TDO_Chained
TMS: U40.14(TMS) ; port TMS
VCC_INT_CPLD1: CC40.2 CC45.2 CON40.1(TESTPIN) U40.8(VCCINT) U40.41(VCCINT) U41.5(OUT)
NetCC44_2: CC44.2 U41.4(CBYP)

Not connected (* = marked no-connect by the designer): U40 29(IO,_DEV_CLRn,_DIFFIO_B5n)* 33(IO,_DIFFIO_B7n)* 42(IO,_CLK3)* 44(IO,_DIFFIO_R2p)* 45(IO)* 46(IO,_DIFFIO_R1n)* 47(IO,_DIFFIO_R1p)* 48(IO)* 49(IO,_DIFFIO_T6n)* 50(IO,_DIFFIO_T6p)* 51(IO)* 52(IO,_DIFFIO_T5n)* 53(IO,_DIFFIO_T5p)* 54(IO,_DIFFIO_T4n)* 55(IO,_DIFFIO_T4p)* 56(IO,_DIFFIO_T3n)* 58(IO,_DIFFIO_T3p)* 59(IO,_DIFFIO_T2n)* 60(IO,_DIFFIO_T2p)* 61(IO,_DIFFIO_T1n)* 62(IO)* 63(IO,_DIFFIO_T1p)*

### Notes on the sheet
- Title:
- Date:
- SVN:
- Ver:
- Sheet Size:
- A3
- Sheet Name:
- OF
- Checked By:
- Drawn By:
- Damian Szczypior
- Rev:
- Alle Rechte vorbehalten. Kopien ohne Erlaubnis der X2E GmbH sind nicht gestattet. Dieses Dokument darf ohne die Erlaubnis der X2E GmbH nicht an Dritte (auch nicht in Auszügen) weitergegeben werden .
- Sheet:
- (in symbol CMP-0217-00123-1, part A) BANK 1
- (in symbol CMP-0217-00123-1, part B) BANK 2

### Library data of the parts
CC40-CC42 CC46 = X_00000681: as CC30 on sheet 03-Intel_CPLD_0; x2e_number: X_00000681; height: mm900; width: mm800; length: 1mm60; package: 0603; series: none
CC43 = X_00001611: as CC33 on sheet 03-Intel_CPLD_0; x2e_number: X_00001611; height: mm800; width: mm800; length: 1mm60; package: 0603; series: M
CC44 = X_00000431: as CC34 on sheet 03-Intel_CPLD_0; x2e_number: X_00000431; height: mm800; width: mm800; length: 1mm60; package: 0603; series: none
CC45 = X_00002029: as CC35 on sheet 03-Intel_CPLD_0; x2e_number: X_00002029; height: mm800; width: mm800; length: 1mm60; package: 0603; series: CL
CON40 = X_00001838: as CON30 on sheet 03-Intel_CPLD_0; editor_date: boos, 06.02.2014; x2e_number: X_00001838; entity_name: CON_001_M_MM000_S_X_MILL-MAX_TP; height: 5mm56; width: 3mm18; length: 3mm18; min_operating_temp: 0C; manufacturer: MILL-MAX; package: THT; shell_material: Tin; series: 2501
U40 = CMP-0217-00123-1: as U30 on sheet 03-Intel_CPLD_0; ComponentLink2URL: http://www.altera.com/literature/hb/max-v/max5_handbook.pdf; ComponentLink4Description: Package Specification; ComponentLink1URL: http://www.altera.com/; ComponentLink1Description: Manufacturer URL; ComponentLink2Description: Datasheet; DatasheetVersion: ver1.2, May-2011; ComponentLink3URL: http://www.altera.com/literature/lit-dp.jsp?category=MAX%205&showspreadsheet=y; ComponentLink4URL: http://www.altera.com/devicepackaging/04R00384-01.pdf; Code_JEDEC: MS-026-ABD-HD; PackageVersion: ver1.0, Jul-2011; PackageDescription: 64-Pin Plastic Enhanced Quad Flat (EQFP) - Wire Bond - A:1.20 - D2:4.5; ComponentLink3Description: MAX V Device Pin-Out files; PackageReference: EQFP64_A-120_D2-45
U41 = CMP-0062-02117-2: as U31 on sheet 03-Intel_CPLD_0; ComponentLink1URL: http://www.national.com/ds/LP/LP2992.pdf; PinCount: 5; PackageReference: MF05A; PackageVersion: revD, Aug-2008; ComponentLink3URL: http://www.national.com/packaging/folders/mf05a.html; DatasheetVersion: May-2005; ComponentLink2URL: http://www.national.com/pf/LP/LP2992.html; RevisionNote: Component URLs added; ComponentLink2Description: LP2992 Web Page; ComponentLink1Description: LP2992 Datasheet; RoHS: Y; PackageDescription: Molded SOT-23, .115 x .063 x .040 in Body, 5 Lead, .0375 in Pitch; ComponentLink3Description: MF05A Package Page

## Sheet 05-Backplane_Connector.SchDoc
size A3
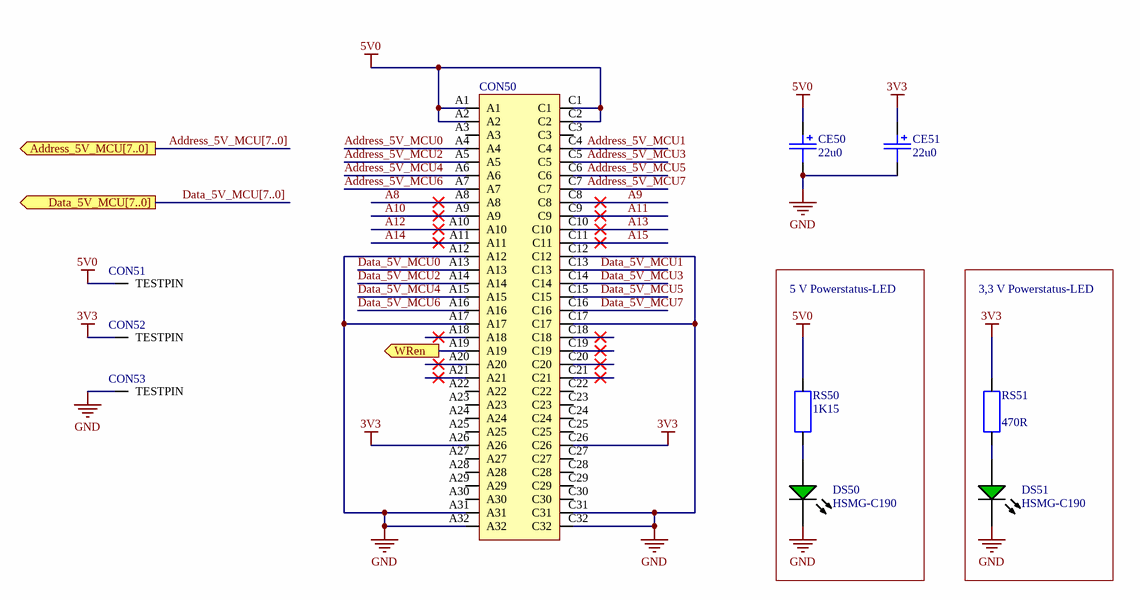
[diagram p5: 05-Backplane_Connector.SchDoc]

### Parts
CE50  22u0  [CE_002_THT_2MM20_S_A]
CE51  22u0  [CE_002_THT_2MM20_S_A]
CON50  103-40034  [CON_064_THT_2MM54_M]  (value not drawn)
CON51  CON_001_M_MM000_S_X_MILL-MAX_TP  [CON_001_THT_MM000_S_D]  (value not drawn)
CON52  CON_001_M_MM000_S_X_MILL-MAX_TP  [CON_001_THT_MM000_S_D]  (value not drawn)
CON53  CON_001_M_MM000_S_X_MILL-MAX_TP  [CON_001_THT_MM000_S_D]  (value not drawn)
DS50  HSMG-C190  [AVAG-HSMX-C190_V]
DS51  HSMG-C190  [AVAG-HSMX-C190_V]
RS50  resistance: 1K15  [0603_A]  (hidden comment: RS)
RS51  resistance: 470R  [0603_A]  (hidden comment: RS)

### Blocks framed on the sheet
5 V Powerstatus-LED: DS50 RS50
3,3 V Powerstatus-LED: DS51 RS51

### Ports
Address_5V_MCU[7..0] (out), Data_5V_MCU[7..0] (out), WRen (out)

### Nets
3V3: CE51.1 CON50.A26 CON50.C26 CON52.1(TESTPIN) RS51.2
5V0: CE50.1 CON50.A1 CON50.A2 CON50.C1 CON50.C2 CON51.1(TESTPIN) RS50.2
GND: CE50.2 CE51.2 CON50.A12 CON50.A17 CON50.A31 CON50.A32 CON50.C12 CON50.C17 CON50.C31 CON50.C32 CON53.1(TESTPIN) DS50.2(K) DS51.2(K)
A8: CON50.A8
A9: CON50.C8
A10: CON50.A9
A11: CON50.C9
A12: CON50.A10
A13: CON50.C10
A14: CON50.A11
A15: CON50.C11
Address_5V_MCU0: CON50.A4
Address_5V_MCU1: CON50.C4
Address_5V_MCU2: CON50.A5
Address_5V_MCU3: CON50.C5
Address_5V_MCU4: CON50.A6
Address_5V_MCU5: CON50.C6
Address_5V_MCU6: CON50.A7
Address_5V_MCU7: CON50.C7
Data_5V_MCU0: CON50.A13
Data_5V_MCU1: CON50.C13
Data_5V_MCU2: CON50.A14
Data_5V_MCU3: CON50.C14
Data_5V_MCU4: CON50.A15
Data_5V_MCU5: CON50.C15
Data_5V_MCU6: CON50.A16
Data_5V_MCU7: CON50.C16
WRen: CON50.A19 ; port WRen
NetDS50_1: DS50.1(A) RS50.1
NetDS51_1: DS51.1(A) RS51.1

Not connected (* = marked no-connect by the designer): CON50 A3 A18* A20* A21* A22 A23 A24 A25 A27 A28 A29 A30 C3 C18* C19* C20* C21* C22 C23 C24 C25 C27 C28 C29 C30

### Buses and harness runs
bus Address_5V_MCU[7..0] =  = port Address_5V_MCU[7..0]
bus Data_5V_MCU[7..0] = port Data_5V_MCU[7..0]

### Notes on the sheet
- Title:
- Date:
- SVN:
- Ver:
- Sheet Size:
- A3
- Sheet Name:
- OF
- Checked By:
- Drawn By:
- Damian Szczypior
- Rev:
- Alle Rechte vorbehalten. Kopien ohne Erlaubnis der X2E GmbH sind nicht gestattet. Dieses Dokument darf ohne die Erlaubnis der X2E GmbH nicht an Dritte (auch nicht in Auszügen) weitergegeben werden .
- Sheet:

### Library data of the parts
CE50 CE51 = CE_RADIAL_22U_50V0_20PO_R07: Teapo Elko TA Series 22µF 50V
CON50 = CON_064_M_2MM54_L_X: C- Male Connector According to IEC 60603-2 (DIN 41612); editor_date: li_08.12.2020
CON51-CON53 = X_00001838: as CON30 on sheet 03-Intel_CPLD_0; editor_date: boos, 06.02.2014; x2e_number: X_00001838; entity_name: CON_001_M_MM000_S_X_MILL-MAX_TP; height: 5mm56; width: 3mm18; length: 3mm18; min_operating_temp: 0C; manufacturer: MILL-MAX; package: THT; shell_material: Tin; series: 2501
DS50 DS51 = CMP-1744-00002-1: as G0 on sheet 09-Peripherials; Packaging: Tape and Reel; PackageReference: HSMX-C190; ComponentLink2URL: http://docs.avagotech.com/docs/AV02-0551EN; RoHSCompliant: true; Pins: 8; REACH SVHC: No SVHC; Max Operating Temperature: 85 degC; Width: 4 mm; Radiation Hardening: No; Package Quantity: 3000; ComponentLink3Description: Package Specification; ComponentLink1Description: Manufacturer URL; Min Operating Temperature: -40 degC; PackageDescription: 2-Pin Surface Mount Device, Body 1.6 x 0.8 mm, Height 0.9 mm; Max Clock Frequency: 100 KHz; Height: 1.5 mm; ComponentLink1URL: http://www.avagotech.com/; DatasheetVersion: Mar-12; ComponentLink2Description: Datasheet; Mount: Surface Mount; Length: 5 mm; ComponentLink3URL: http://www.fairchildsemi.com/dwg/MA/MA03D.pdf
RS50 = X_00000390: manufacturer: Yageo; entity_name: RS_0603_1K15_W100_1P00_100PPM; entity_type_name: resistor_standard; power: W100; temp_coefficient: 100PPM; tolerance: 1P00; release: blocked; max_operating_temp: 125C; min_operating_temp: -55C; ordering_information_btm: 541-1.15KHCT-ND; used_in_bom: 1; production_status: Aktiv; x2e_number: X_00000390; series: RC0603; height: mm450; width: mm800; length: 1mm60; package: 0603
RS51 = X_00000061: as RS_G0 on sheet 09-Peripherials; x2e_number: X_00000061; series: RC0603; height: mm450; width: mm800; length: 1mm60; package: 0603

## Sheet 06-LevelShifter.SchDoc
size A3; SheetNumber: 6; SheetTotal: 6
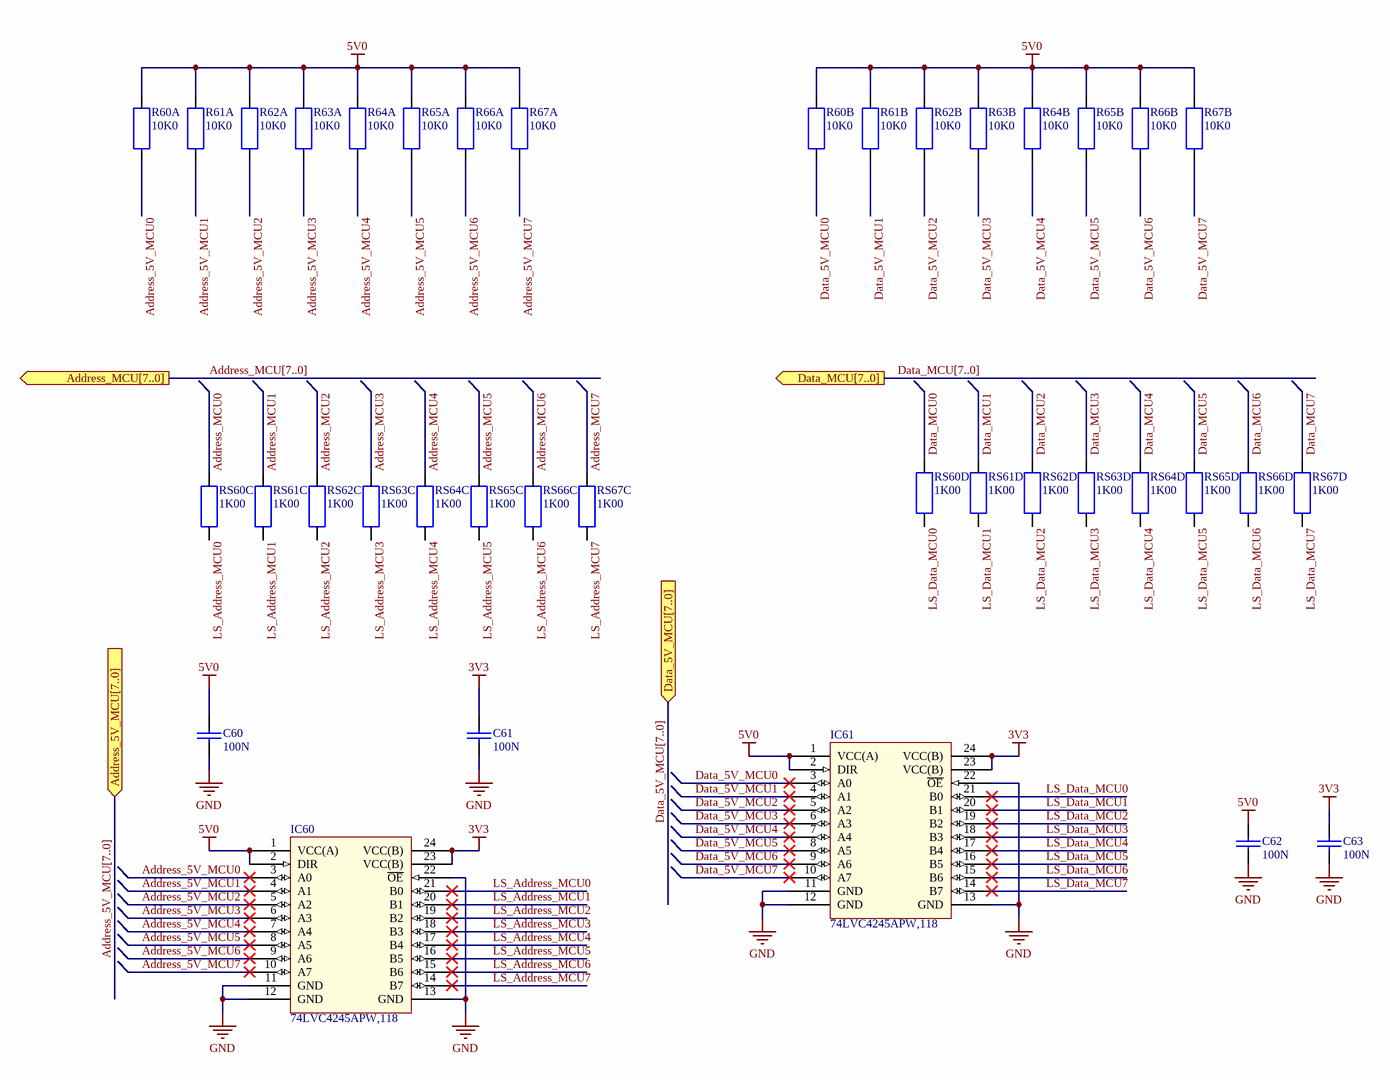
[diagram p6: 06-LevelShifter.SchDoc]

### Parts
C60  capacitance: 100N  [0603_C]  (hidden comment: CC)
C61  capacitance: 100N  [0603_C]  (hidden comment: CC)
C62  capacitance: 100N  [0603_C]  (hidden comment: CC)
C63  capacitance: 100N  [0603_C]  (hidden comment: CC)
IC60  entity_name: 74LVC4245APW,118  [TSSOP24]  (hidden comment: IC_74LVC4245APW118_TSSOP24)
IC61  entity_name: 74LVC4245APW,118  [TSSOP24]  (hidden comment: IC_74LVC4245APW118_TSSOP24)
R60A  resistance: 10K0  [0603_A]  (hidden comment: RS)
R60B  resistance: 10K0  [0603_A]  (hidden comment: RS)
R61A  resistance: 10K0  [0603_A]  (hidden comment: RS)
R61B  resistance: 10K0  [0603_A]  (hidden comment: RS)
R62A  resistance: 10K0  [0603_A]  (hidden comment: RS)
R62B  resistance: 10K0  [0603_A]  (hidden comment: RS)
R63A  resistance: 10K0  [0603_A]  (hidden comment: RS)
R63B  resistance: 10K0  [0603_A]  (hidden comment: RS)
R64A  resistance: 10K0  [0603_A]  (hidden comment: RS)
R64B  resistance: 10K0  [0603_A]  (hidden comment: RS)
R65A  resistance: 10K0  [0603_A]  (hidden comment: RS)
R65B  resistance: 10K0  [0603_A]  (hidden comment: RS)
R66A  resistance: 10K0  [0603_A]  (hidden comment: RS)
R66B  resistance: 10K0  [0603_A]  (hidden comment: RS)
R67A  resistance: 10K0  [0603_A]  (hidden comment: RS)
R67B  resistance: 10K0  [0603_A]  (hidden comment: RS)
RS60C  resistance: 1K00  [0603_A]  (hidden comment: RS)
RS60D  resistance: 1K00  [0603_A]  (hidden comment: RS)
RS61C  resistance: 1K00  [0603_A]  (hidden comment: RS)
RS61D  resistance: 1K00  [0603_A]  (hidden comment: RS)
RS62C  resistance: 1K00  [0603_A]  (hidden comment: RS)
RS62D  resistance: 1K00  [0603_A]  (hidden comment: RS)
RS63C  resistance: 1K00  [0603_A]  (hidden comment: RS)
RS63D  resistance: 1K00  [0603_A]  (hidden comment: RS)
RS64C  resistance: 1K00  [0603_A]  (hidden comment: RS)
RS64D  resistance: 1K00  [0603_A]  (hidden comment: RS)
RS65C  resistance: 1K00  [0603_A]  (hidden comment: RS)
RS65D  resistance: 1K00  [0603_A]  (hidden comment: RS)
RS66C  resistance: 1K00  [0603_A]  (hidden comment: RS)
RS66D  resistance: 1K00  [0603_A]  (hidden comment: RS)
RS67C  resistance: 1K00  [0603_A]  (hidden comment: RS)
RS67D  resistance: 1K00  [0603_A]  (hidden comment: RS)

### Ports
Address_5V_MCU[7..0] (in), Address_MCU[7..0] (out), Data_5V_MCU[7..0] (in), Data_MCU[7..0] (out)

### Nets
3V3: C61.1 C63.1 IC60.23(VCC(B)) IC60.24(VCC(B)) IC61.23(VCC(B)) IC61.24(VCC(B))
5V0: C60.1 C62.1 IC60.1(VCC(A)) IC60.2(DIR) IC61.1(VCC(A)) IC61.2(DIR) R60A.2 R60B.2 R61A.2 R61B.2 R62A.2 R62B.2 R63A.2 R63B.2 R64A.2 R64B.2 R65A.2 R65B.2 R66A.2 R66B.2 R67A.2 R67B.2
GND: C60.2 C61.2 C62.2 C63.2 IC60.11(GND) IC60.12(GND) IC60.13(GND) IC60.22(~{OE}) IC61.11(GND) IC61.12(GND) IC61.13(GND) IC61.22(~{OE})
Address_5V_MCU0: IC60.3(A0) R60A.1
Address_5V_MCU1: IC60.4(A1) R61A.1
Address_5V_MCU2: IC60.5(A2) R62A.1
Address_5V_MCU3: IC60.6(A3) R63A.1
Address_5V_MCU4: IC60.7(A4) R64A.1
Address_5V_MCU5: IC60.8(A5) R65A.1
Address_5V_MCU6: IC60.9(A6) R66A.1
Address_5V_MCU7: IC60.10(A7) R67A.1
Address_MCU0: RS60C.2
Address_MCU1: RS61C.2
Address_MCU2: RS62C.2
Address_MCU3: RS63C.2
Address_MCU4: RS64C.2
Address_MCU5: RS65C.2
Address_MCU6: RS66C.2
Address_MCU7: RS67C.2
Data_5V_MCU0: IC61.3(A0) R60B.1
Data_5V_MCU1: IC61.4(A1) R61B.1
Data_5V_MCU2: IC61.5(A2) R62B.1
Data_5V_MCU3: IC61.6(A3) R63B.1
Data_5V_MCU4: IC61.7(A4) R64B.1
Data_5V_MCU5: IC61.8(A5) R65B.1
Data_5V_MCU6: IC61.9(A6) R66B.1
Data_5V_MCU7: IC61.10(A7) R67B.1
Data_MCU0: RS60D.2
Data_MCU1: RS61D.2
Data_MCU2: RS62D.2
Data_MCU3: RS63D.2
Data_MCU4: RS64D.2
Data_MCU5: RS65D.2
Data_MCU6: RS66D.2
Data_MCU7: RS67D.2
LS_Address_MCU0: IC60.21(B0) RS60C.1
LS_Address_MCU1: IC60.20(B1) RS61C.1
LS_Address_MCU2: IC60.19(B2) RS62C.1
LS_Address_MCU3: IC60.18(B3) RS63C.1
LS_Address_MCU4: IC60.17(B4) RS64C.1
LS_Address_MCU5: IC60.16(B5) RS65C.1
LS_Address_MCU6: IC60.15(B6) RS66C.1
LS_Address_MCU7: IC60.14(B7) RS67C.1
LS_Data_MCU0: IC61.21(B0) RS60D.1
LS_Data_MCU1: IC61.20(B1) RS61D.1
LS_Data_MCU2: IC61.19(B2) RS62D.1
LS_Data_MCU3: IC61.18(B3) RS63D.1
LS_Data_MCU4: IC61.17(B4) RS64D.1
LS_Data_MCU5: IC61.16(B5) RS65D.1
LS_Data_MCU6: IC61.15(B6) RS66D.1
LS_Data_MCU7: IC61.14(B7) RS67D.1

### Buses and harness runs
bus Address_5V_MCU[7..0] = port Address_5V_MCU[7..0]
bus Address_MCU[7..0] =  = port Address_MCU[7..0]
bus Data_5V_MCU[7..0] = port Data_5V_MCU[7..0]
bus Data_MCU[7..0] =  = port Data_MCU[7..0]

### Notes on the sheet
- Title:
- Date:
- SVN:
- Ver:
- Sheet Size:
- A3
- Sheet Name:
- OF
- Checked By:
- Drawn By:
- Damian Szczypior
- Rev:
- Alle Rechte vorbehalten. Kopien ohne Erlaubnis der X2E GmbH sind nicht gestattet. Dieses Dokument darf ohne die Erlaubnis der X2E GmbH nicht an Dritte (auch nicht in Auszügen) weitergegeben werden .
- Sheet:

### Library data of the parts
C60-C63 = X_00004988: manufacturer: Kemet; entity_name: CC_0603_100N_50V0_10P0_X7R_Kemet; entity_type_name: capacitor_ceramic; temp_coefficient: X7R; release: blocked; max_operating_temp: 125C; min_operating_temp: -55C; tolerance: 10P0; voltage_rated: 50V0; ordering_information_btm: 801-5347; used_in_bom: 0; production_status: Aktiv; x2e_number: X_00004988; height: mm800; width: mm800; length: 1mm60; package: 0603; series: none
IC60 IC61 = IC_74LVC4245APW118_TSSOP24: ic, logic, bus switch, level shifter; manufacturer: IDT; manufacture_name: IDTQS3384QG8; ordering_information: digikey, 800-1739-1-ND; x2e_number: X_00000794; propagation_delay: 250P; data_rate: bps000; number_of_channels: 001; release: blocked; number_of_bits: 010; max_operating_temp: 85C; min_operating_temp: -40C; vcc_max: 5V25; vcc_min: 4V75; ordering_information_btm: 800-1739-2-ND; used_in_bom: 1; production_status: Aktiv; entity_type_name: levelshifter; output_type: logic; input_type: logic; height: 1mm73; width: 3mm90; length: 8mm89; series: none; package: SSOP24; revision: none
R60A R60B R61A R61B R62A R62B R63A R63B R64A R64B R65A R65B R66A R66B R67A R67B = X_00000001: manufacturer: Yageo; entity_name: RS_0603_10K0_W100_1P00_100PPM; entity_type_name: resistor_standard; power: W100; temp_coefficient: 100PPM; tolerance: 1P00; release: blocked; max_operating_temp: 125C; min_operating_temp: -55C; ordering_information_btm: 311-10.0KHRCT-ND; used_in_bom: 1; production_status: Aktiv; x2e_number: X_00000001; series: RC0603; height: mm450; width: mm800; length: 1mm60; package: 0603
RS60C RS60D RS61C RS61D RS62C RS62D RS63C RS63D RS64C RS64D RS65C RS65D RS66C RS66D RS67C RS67D = X_00000034: manufacturer: Yageo; entity_name: RS_0603_1K00_W100_1P00_100PPM; entity_type_name: resistor_standard; power: W100; temp_coefficient: 100PPM; tolerance: 1P00; release: blocked; max_operating_temp: 125C; min_operating_temp: -55C; ordering_information_btm: 504-8928; used_in_bom: 1; production_status: Aktiv; x2e_number: X_00000034; series: RC0603; height: mm450; width: mm800; length: 1mm60; package: 0603

## Sheet 08-Clock.SchDoc
size A3; SheetNumber: 4; SheetTotal: 7
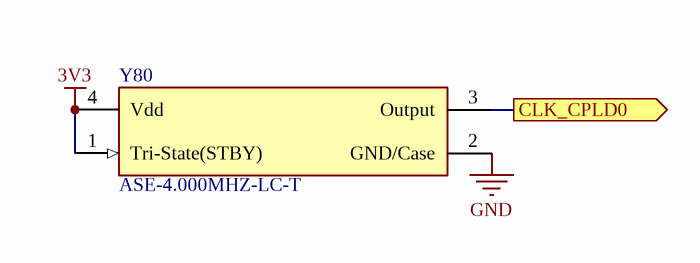
[diagram p7: 08-Clock.SchDoc]

### Parts
Y80  ASE-4.000MHZ-LC-T  [ASE-4.000MHZ-LC-T_HandSoldering]

### Ports
CLK_CPLD0 (out)

### Nets
3V3: Y80.1(Tri-State(STBY)) Y80.4(Vdd)
GND: Y80.2(GND/Case)
CLK_CPLD0: Y80.3(Output) ; port CLK_CPLD0

### Notes on the sheet
- Title:
- Date:
- SVN:
- Ver:
- Sheet Size:
- A3
- Sheet Name:
- OF
- Checked By:
- Drawn By:
- Damian Szczypior
- Rev:
- Alle Rechte vorbehalten. Kopien ohne Erlaubnis der X2E GmbH sind nicht gestattet. Dieses Dokument darf ohne die Erlaubnis der X2E GmbH nicht an Dritte (auch nicht in Auszügen) weitergegeben werden .
- Sheet:

### Library data of the parts
Y80 = OC_SMD_4MHz_3V3_ASE: XTAL OSC XO 4.0000MHZ CMOS SMD; ComponentLink1Description: Datasheet; ComponentLink1URL: https://abracon.com/Oscillators/ASEseries.pdf

## Sheet 07-FPM_Connector.SchDoc
size A3
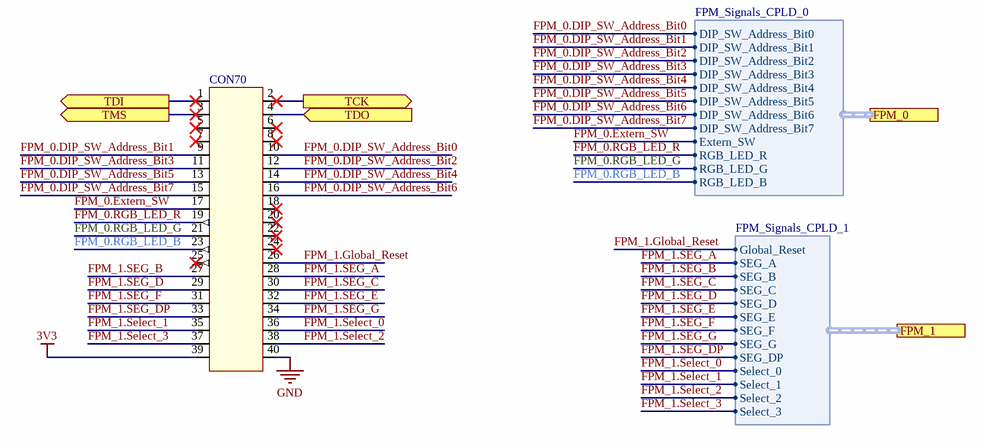
[diagram p8: 07-FPM_Connector.SchDoc]

### Parts
CON70  CON_040_M_2MM54_S_A  [CON_040_THT_2MM54_S_A]  (value not drawn)

### Ports
FPM_0 (harness FPM_Signals_CPLD_0), FPM_1 (harness FPM_Signals_CPLD_1), TCK (out), TDI (out), TDO (in), TMS (out)

### Harnesses
FPM_Signals_CPLD_1: Global_Reset, SEG_A, SEG_B, SEG_C, SEG_D, SEG_DP, SEG_E, SEG_F, SEG_G, Select_0, Select_1, Select_2, Select_3
FPM_Signals_CPLD_0: DIP_SW_Address_Bit0, DIP_SW_Address_Bit1, DIP_SW_Address_Bit2, DIP_SW_Address_Bit3, DIP_SW_Address_Bit4, DIP_SW_Address_Bit5, DIP_SW_Address_Bit6, DIP_SW_Address_Bit7, Extern_SW, RGB_LED_B, RGB_LED_G, RGB_LED_R

### Nets
3V3: CON70.39
GND: CON70.40
FPM_0.DIP_SW_Address_Bit0: CON70.10 ; port FPM_0.DIP_SW_Address_Bit0
FPM_0.DIP_SW_Address_Bit1: CON70.9 ; port FPM_0.DIP_SW_Address_Bit1
FPM_0.DIP_SW_Address_Bit2: CON70.12 ; port FPM_0.DIP_SW_Address_Bit2
FPM_0.DIP_SW_Address_Bit3: CON70.11 ; port FPM_0.DIP_SW_Address_Bit3
FPM_0.DIP_SW_Address_Bit4: CON70.14 ; port FPM_0.DIP_SW_Address_Bit4
FPM_0.DIP_SW_Address_Bit5: CON70.13 ; port FPM_0.DIP_SW_Address_Bit5
FPM_0.DIP_SW_Address_Bit6: CON70.16 ; port FPM_0.DIP_SW_Address_Bit6
FPM_0.DIP_SW_Address_Bit7: CON70.15 ; port FPM_0.DIP_SW_Address_Bit7
FPM_0.Extern_SW: CON70.17 ; port FPM_0.Extern_SW
FPM_0.RGB_LED_B: CON70.23 ; port FPM_0.RGB_LED_B
FPM_0.RGB_LED_G: CON70.21 ; port FPM_0.RGB_LED_G
FPM_0.RGB_LED_R: CON70.19 ; port FPM_0.RGB_LED_R
FPM_1.Global_Reset: CON70.26 ; port FPM_1.Global_Reset
FPM_1.SEG_A: CON70.28 ; port FPM_1.SEG_A
FPM_1.SEG_B: CON70.27 ; port FPM_1.SEG_B
FPM_1.SEG_C: CON70.30 ; port FPM_1.SEG_C
FPM_1.SEG_D: CON70.29 ; port FPM_1.SEG_D
FPM_1.SEG_DP: CON70.33 ; port FPM_1.SEG_DP
FPM_1.SEG_E: CON70.32 ; port FPM_1.SEG_E
FPM_1.SEG_F: CON70.31 ; port FPM_1.SEG_F
FPM_1.SEG_G: CON70.34 ; port FPM_1.SEG_G
FPM_1.Select_0: CON70.36 ; port FPM_1.Select_0
FPM_1.Select_1: CON70.35 ; port FPM_1.Select_1
FPM_1.Select_2: CON70.38 ; port FPM_1.Select_2
FPM_1.Select_3: CON70.37 ; port FPM_1.Select_3
TCK: CON70.2 ; port TCK
TDI: CON70.1 ; port TDI
TDO: CON70.4 ; port TDO
TMS: CON70.3 ; port TMS

Not connected (* = marked no-connect by the designer): CON70 5* 6* 7* 8* 18* 20* 22* 24* 25*

### Notes on the sheet
- Title:
- Date:
- SVN:
- Ver:
- Sheet Size:
- A3
- Sheet Name:
- OF
- Checked By:
- Drawn By:
- Damian Szczypior
- Rev:
- Alle Rechte vorbehalten. Kopien ohne Erlaubnis der X2E GmbH sind nicht gestattet. Dieses Dokument darf ohne die Erlaubnis der X2E GmbH nicht an Dritte (auch nicht in Auszügen) weitergegeben werden .
- Sheet:

### Library data of the parts
CON70 = X_00006869: Connector Header Through Hole 40 position 2.54mm; manufacturer: On Shore Technology Inc.; manufacturer_partnumber: 302-S401; Parameter 3: Digi-Key ED10529-ND; entity_name: CON_040_M_2MM54_S_A_CON HEADER 40 POS; release: blocked; max_operating_temp: 105C; min_operating_temp: -40C; grid: 2MM54; pin_count_type: A; mounting_type: S; gender: M; number_of_electronic_pins: 040; ordering_information_btm: ED10529-ND; used_in_bom: 0; production_status: Aktiv; editor_date: niemiec_14.05.2020; x2e_number: X_00006869; entity_type_name: connector; height: 8mm80; width: 9mm05; length: 58mm4; package: THT; shell_material: Polyester, Glass Filled; features: Connector Header Through Hole 40 position 0.100" (2.54mm); series: 302

## Sheet 10-Mechanic.SchDoc: Mechanik
size A3; Engineer: Nader Aribi; Revision: 0.00; SheetNumber: 10; SheetTotal: 10; Version: 1.00; PageSetup: Record=PageOptions|CenterHorizontal=True|CenterVertical=True|PrintScale=1.01|XCorrection=1.00|YCorrection=1.00|PrintKind=0|BorderSize=5000000|LeftOffset=0|BottomOffset=0|Orientation=2|PaperLength=1000|PaperWidth=1000|Scale=100|PaperSource=15|PrintQuality=600|MediaType=1|DitherType=10|PrintScaleMode=1|PaperKind=A3
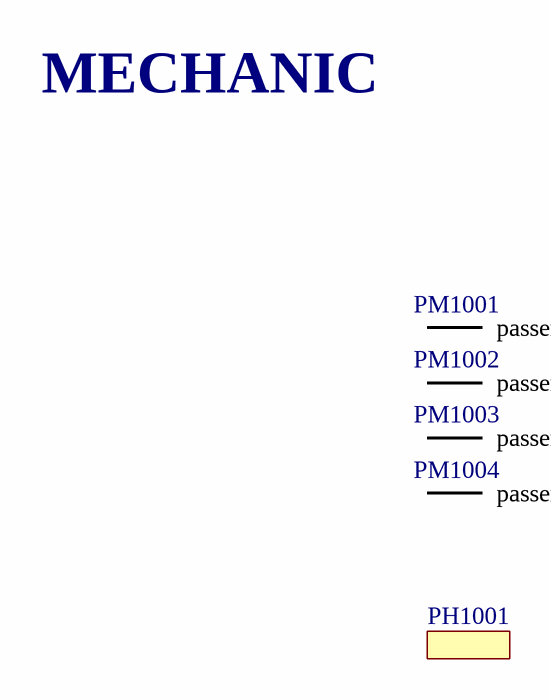
[diagram p9: 10-Mechanic.SchDoc]

### Parts
PH1001  PH_25MM00_8MM00  [PH_25MM00_8MM00_PCB]  (value not drawn)
PM1001  PM_1MM50_MM000  [PM_1MM50_PCB]  (value not drawn)
PM1002  PM_1MM50_MM000  [PM_1MM50_PCB]  (value not drawn)
PM1003  PM_1MM50_MM000  [PM_1MM50_PCB]  (value not drawn)
PM1004  PM_1MM50_MM000  [PM_1MM50_PCB]  (value not drawn)

### Nets

Not connected (* = marked no-connect by the designer): PM1001 1(passer_mark); PM1002 1(passer_mark); PM1003 1(passer_mark); PM1004 1(passer_mark)

### Notes on the sheet
- MECHANIC
- Title:
- Date:
- SVN:
- Ver:
- Sheet Size:
- A3
- Sheet Name:
- OF
- Checked By:
- Drawn By:
- Damian Szczypior
- Rev:
- Alle Rechte vorbehalten. Kopien ohne Erlaubnis der X2E GmbH sind nicht gestattet. Dieses Dokument darf ohne die Erlaubnis der X2E GmbH nicht an Dritte (auch nicht in Auszügen) weitergegeben werden .
- Sheet:

### Library data of the parts
PH1001 = PH_25MM00_8MM00: Tag; library_path: Y:\lib\pads_stable\mechanic; dimension_a: 25MM0; dimension_b: 8MM00; editor_date: lavan,23.01.2013; footprint_path: Y:\lib\pads_stable; footprint_ref: PH_25MM00_8MM00_PCB; library_ref: PH_25MM00_8MM00
PM1001-PM1004 = PM_1MM50_MM000: passer mark; library_path: Y:\lib\pads_stable\mechanic; dimension_a: 1MM50; dimension_b: MM000; editor_date: lavan,14.01.2013; footprint_path: Y:\lib\pads_stable; footprint_ref: PM_1MM50_PCB; library_ref: PM_1MM50_MM000

## Nets that join several sheets
3V3: 02-BlockChart (P20.4), 03-Intel_CPLD_0 (9 pins), 04-Intel_CPLD_1 (10 pins), 05-Backplane_Connector (5 pins), 06-LevelShifter (6 pins), 08-Clock (Y80.1 Y80.4), 07-FPM_Connector (CON70.39)
5V0: 05-Backplane_Connector (7 pins), 06-LevelShifter (22 pins)
GND: 02-BlockChart (P20.2 P20.10), 09-Peripherials (9 pins), 03-Intel_CPLD_0 (8 pins), 04-Intel_CPLD_1 (9 pins), 05-Backplane_Connector (13 pins), 06-LevelShifter (12 pins), 08-Clock (Y80.2), 07-FPM_Connector (CON70.40)
Address_5V_MCU0: 05-Backplane_Connector (CON50.A4), 06-LevelShifter (IC60.3 R60A.1)
Address_5V_MCU1: 05-Backplane_Connector (CON50.C4), 06-LevelShifter (IC60.4 R61A.1)
Address_5V_MCU2: 05-Backplane_Connector (CON50.A5), 06-LevelShifter (IC60.5 R62A.1)
Address_5V_MCU3: 05-Backplane_Connector (CON50.C5), 06-LevelShifter (IC60.6 R63A.1)
Address_5V_MCU4: 05-Backplane_Connector (CON50.A6), 06-LevelShifter (IC60.7 R64A.1)
Address_5V_MCU5: 05-Backplane_Connector (CON50.C6), 06-LevelShifter (IC60.8 R65A.1)
Address_5V_MCU6: 05-Backplane_Connector (CON50.A7), 06-LevelShifter (IC60.9 R66A.1)
Address_5V_MCU7: 05-Backplane_Connector (CON50.C7), 06-LevelShifter (IC60.10 R67A.1)
CLK_CPLD0: 03-Intel_CPLD_0 (U30.40), 08-Clock (Y80.3)
CLK_CPLD1: 03-Intel_CPLD_0 (U30.7), 04-Intel_CPLD_1 (U40.40)
Data_5V_MCU0: 05-Backplane_Connector (CON50.A13), 06-LevelShifter (IC61.3 R60B.1)
Data_5V_MCU1: 05-Backplane_Connector (CON50.C13), 06-LevelShifter (IC61.4 R61B.1)
Data_5V_MCU2: 05-Backplane_Connector (CON50.A14), 06-LevelShifter (IC61.5 R62B.1)
Data_5V_MCU3: 05-Backplane_Connector (CON50.C14), 06-LevelShifter (IC61.6 R63B.1)
Data_5V_MCU4: 05-Backplane_Connector (CON50.A15), 06-LevelShifter (IC61.7 R64B.1)
Data_5V_MCU5: 05-Backplane_Connector (CON50.C15), 06-LevelShifter (IC61.8 R65B.1)
Data_5V_MCU6: 05-Backplane_Connector (CON50.A16), 06-LevelShifter (IC61.9 R66B.1)
Data_5V_MCU7: 05-Backplane_Connector (CON50.C16), 06-LevelShifter (IC61.10 R67B.1)
Extern_Enable: 03-Intel_CPLD_0 (U30.55), 04-Intel_CPLD_1 (U40.28)
FPM_0.DIP_SW_Address_Bit0: 03-Intel_CPLD_0 (U30.5), 07-FPM_Connector (CON70.10)
FPM_0.DIP_SW_Address_Bit1: 03-Intel_CPLD_0 (U30.4), 07-FPM_Connector (CON70.9)
FPM_0.DIP_SW_Address_Bit2: 03-Intel_CPLD_0 (U30.3), 07-FPM_Connector (CON70.12)
FPM_0.DIP_SW_Address_Bit3: 03-Intel_CPLD_0 (U30.2), 07-FPM_Connector (CON70.11)
FPM_0.DIP_SW_Address_Bit4: 03-Intel_CPLD_0 (U30.1), 07-FPM_Connector (CON70.14)
FPM_0.DIP_SW_Address_Bit5: 03-Intel_CPLD_0 (U30.64), 07-FPM_Connector (CON70.13)
FPM_0.DIP_SW_Address_Bit6: 03-Intel_CPLD_0 (U30.63), 07-FPM_Connector (CON70.16)
FPM_0.DIP_SW_Address_Bit7: 03-Intel_CPLD_0 (U30.62), 07-FPM_Connector (CON70.15)
FPM_0.Extern_SW: 03-Intel_CPLD_0 (U30.61), 07-FPM_Connector (CON70.17)
FPM_0.RGB_LED_B: 03-Intel_CPLD_0 (U30.58), 07-FPM_Connector (CON70.23)
FPM_0.RGB_LED_G: 03-Intel_CPLD_0 (U30.59), 07-FPM_Connector (CON70.21)
FPM_0.RGB_LED_R: 03-Intel_CPLD_0 (U30.60), 07-FPM_Connector (CON70.19)
FPM_1.Global_Reset: 03-Intel_CPLD_0 (U30.56), 04-Intel_CPLD_1 (U40.27), 07-FPM_Connector (CON70.26)
FPM_1.SEG_A: 04-Intel_CPLD_1 (U40.13), 07-FPM_Connector (CON70.28)
FPM_1.SEG_B: 04-Intel_CPLD_1 (U40.12), 07-FPM_Connector (CON70.27)
FPM_1.SEG_C: 04-Intel_CPLD_1 (U40.11), 07-FPM_Connector (CON70.30)
FPM_1.SEG_D: 04-Intel_CPLD_1 (U40.10), 07-FPM_Connector (CON70.29)
FPM_1.SEG_DP: 04-Intel_CPLD_1 (U40.4), 07-FPM_Connector (CON70.33)
FPM_1.SEG_E: 04-Intel_CPLD_1 (U40.9), 07-FPM_Connector (CON70.32)
FPM_1.SEG_F: 04-Intel_CPLD_1 (U40.7), 07-FPM_Connector (CON70.31)
FPM_1.SEG_G: 04-Intel_CPLD_1 (U40.5), 07-FPM_Connector (CON70.34)
FPM_1.Select_0: 04-Intel_CPLD_1 (U40.3), 07-FPM_Connector (CON70.36)
FPM_1.Select_1: 04-Intel_CPLD_1 (U40.2), 07-FPM_Connector (CON70.35)
FPM_1.Select_2: 04-Intel_CPLD_1 (U40.1), 07-FPM_Connector (CON70.38)
FPM_1.Select_3: 04-Intel_CPLD_1 (U40.64), 07-FPM_Connector (CON70.37)
Peripherial_Signals.LED_G0: 09-Peripherials (RS_G0.2), 04-Intel_CPLD_1 (U40.32)
Peripherial_Signals.LED_G1: 09-Peripherials (RS_G1.2), 04-Intel_CPLD_1 (U40.31)
Peripherial_Signals.LED_G2: 09-Peripherials (RS_G2.2), 04-Intel_CPLD_1 (U40.30)
Peripherial_Signals.LED_R0: 09-Peripherials (RS_R0.2), 04-Intel_CPLD_1 (U40.43)
Peripherial_Signals.LED_R1: 09-Peripherials (RS_R1.2), 04-Intel_CPLD_1 (U40.38)
Peripherial_Signals.LED_R2: 09-Peripherials (RS_R2.2), 04-Intel_CPLD_1 (U40.37)
Peripherial_Signals.LED_Y0: 09-Peripherials (RS_Y0.2), 04-Intel_CPLD_1 (U40.36)
Peripherial_Signals.LED_Y1: 09-Peripherials (RS_Y1.2), 04-Intel_CPLD_1 (U40.35)
Peripherial_Signals.LED_Y2: 09-Peripherials (RS_Y2.2), 04-Intel_CPLD_1 (U40.34)
TCK: 02-BlockChart (P20.1), 03-Intel_CPLD_0 (U30.16), 04-Intel_CPLD_1 (U40.16), 07-FPM_Connector (CON70.2)
TDI: 02-BlockChart (P20.9), 03-Intel_CPLD_0 (U30.15), 07-FPM_Connector (CON70.1)
TDO: 02-BlockChart (P20.3), 04-Intel_CPLD_1 (U40.17), 07-FPM_Connector (CON70.4)
TDO_Chained: 03-Intel_CPLD_0 (U30.17), 04-Intel_CPLD_1 (U40.15)
TMS: 02-BlockChart (P20.5), 03-Intel_CPLD_0 (U30.14), 04-Intel_CPLD_1 (U40.14), 07-FPM_Connector (CON70.3)
WRen: 03-Intel_CPLD_0 (U30.37), 05-Backplane_Connector (CON50.A19)